# Altium project MotionBoard.PrjPcb (part 2 of 3)

## Sheet dsp.SchDoc: DSP (TMS320F28388) Connectivity
size A3; SheetNumber: 4; SheetTotal: 18
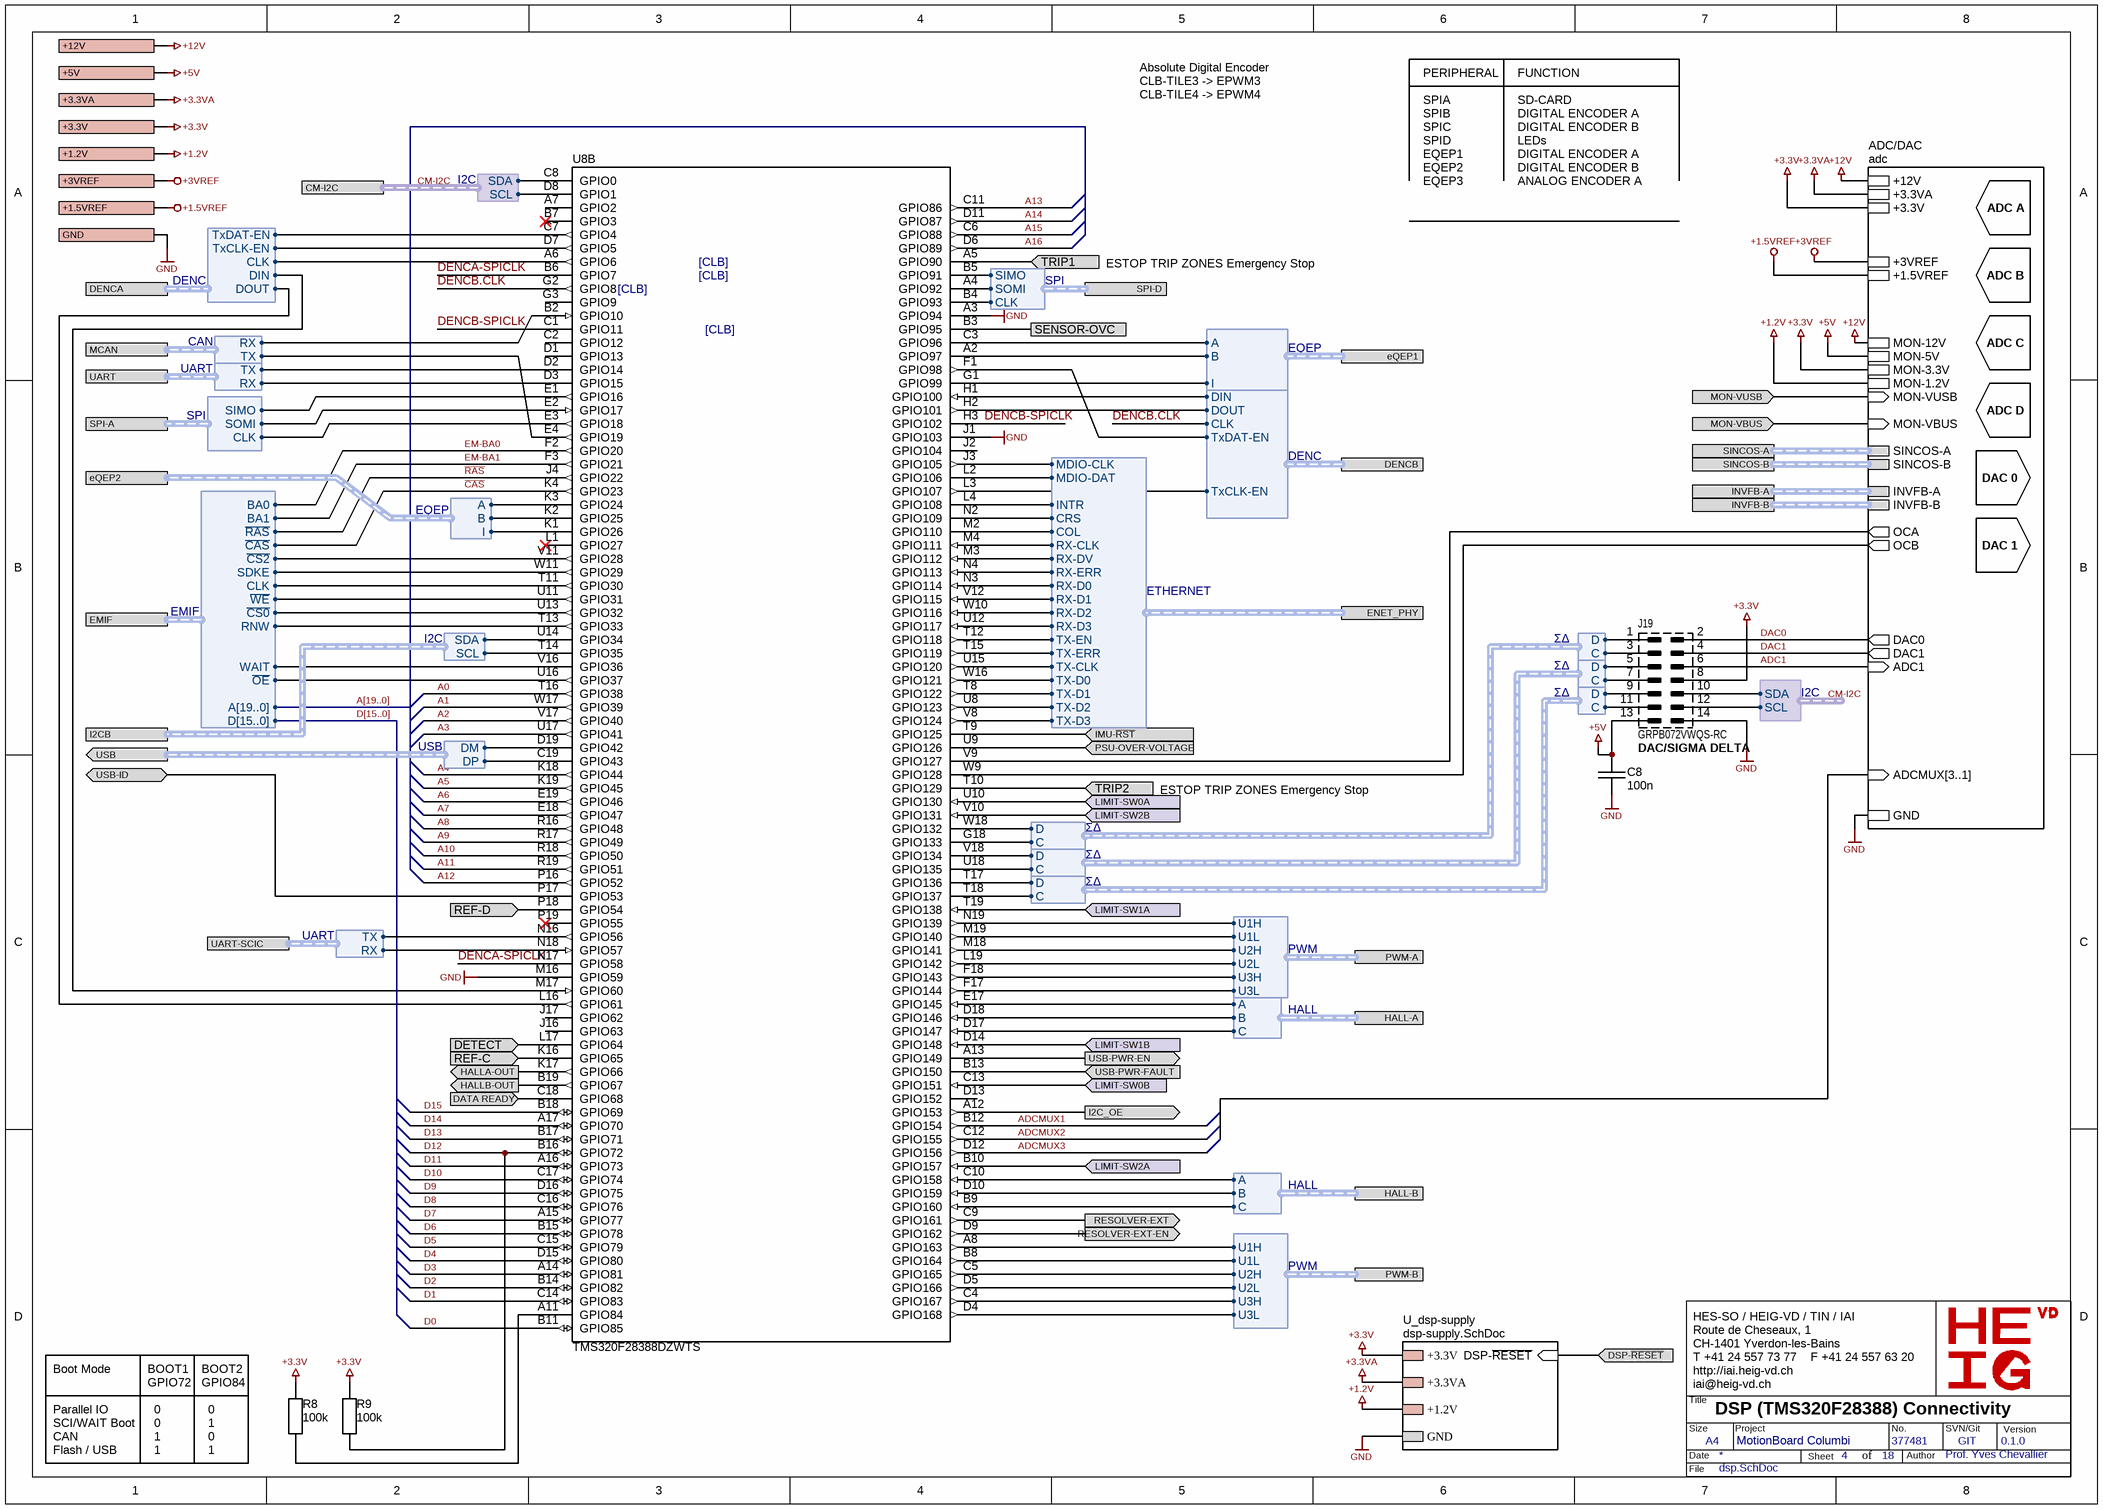
[diagram p5: dsp.SchDoc]

### Parts
C8  100n  [SM/C0402]
J19  GRPB072VWQS-RC  Function: DAC/SIGMA DELTA  [FTSH-107-04-LM-DV]
R8  100k  [SM/R0805]
R9  100k  [SM/R0805]
U8  TMS320F28388DZWTS  [BGA337C80P19X19_1600X1600X140]  (part B of 4)

### Sub-sheets
ADC/DAC = adc: INVFB-A (harness INVFB), INVFB-B (harness INVFB), SINCOS-A (harness SINCOS), SINCOS-B (harness SINCOS), +3.3VA, GND, +3.3V, OCB (out), OCA (out), ADC1 (in), MON-VUSB (in), MON-VBUS (in), DAC1 (out), DAC0 (out), +12V, MON-3.3V, MON-1.2V, MON-5V, MON-12V, +1.5VREF, +3VREF, ADCMUX[3..1] (in)
U_dsp-supply = dsp-supply.SchDoc: +3.3V, GND, +1.2V, +3.3VA, DSP-~{RESET} (in)

### Ports
+1.2V, +1.5VREF, +3.3V, +3.3VA, +3VREF, +5V, +12V, CM-I2C (harness I2C), DATA READY (in), DENCA (harness DENC), DENCB (harness DENC), DETECT (in), DSP-~{RESET} (in), EMIF (harness EMIF), ENET_PHY (harness ETHERNET), eQEP1 (harness EQEP), eQEP2 (harness EQEP), GND, HALL-A (harness HALL), HALL-B (harness HALL), HALLA-OUT (out), HALLB-OUT (out), I2C_OE (out), I2CB (harness I2C), IMU-~{RST} (in), INVFB-A (harness INVFB), INVFB-B (harness INVFB), LIMIT-SW0A (in), LIMIT-SW0B (in), LIMIT-SW1A (in), LIMIT-SW1B (in), LIMIT-SW2A (in), LIMIT-SW2B (in), MCAN (harness CAN), MON-VBUS (in), MON-VUSB (in), PSU-OVER-VOLTAGE (in), PWM-A (harness PWM), PWM-B (harness PWM), REF-C (in), REF-D (in), RESOLVER-EXT (out), RESOLVER-EXT-EN (out), SENSOR-OVC, SINCOS-A (harness SINCOS), SINCOS-B (harness SINCOS), SPI-A (harness SPI), SPI-D (harness SPI), TRIP1 (in), TRIP2 (in), UART (harness UART), UART-SCIC (harness UART), USB (out, harness USB), USB-ID (bidir), USB-PWR-EN (out), USB-PWR-FAULT (in)

### Harnesses
ETHERNET: TX-D0, TX-D1, TX-D2, TX-D3, RX-D0, RX-D1, RX-D2, RX-D3, TX-CLK, TX-EN, RX-CLK, RX-DV, TX-ERR, COL, CRS, RX-ERR, MDIO-CLK, MDIO-DAT, INTR
I2C: SDA, SCL
CAN: RX, TX
USB: DP, DM
EQEP: A, B, I
ΣΔ: C, D
EMIF: A[19..0], D[15..0], ~{RAS}, ~{CAS}, ~{OE}, SDKE, CLK, ~{CS0}, ~{CS2}, BA0, BA1, ~{WE}, RNW, WAIT
UART: TX, RX
PWM: U1H, U1L, U2H, U2L, U3H, U3L
HALL: A, B, C
DENC: CLK, DIN, DOUT, TxCLK-EN, TxDAT-EN
SPI: SIMO, SOMI, CLK

### Nets
+1.2V: port +1.2V, sheet ADC/DAC/MON-1.2V, sheet U_dsp-supply/+1.2V
+1.5VREF: port +1.5VREF, sheet ADC/DAC/+1.5VREF
+3.3V: J19.8 R8.1 R9.1 ; port +3.3V, sheet ADC/DAC/+3.3V, sheet ADC/DAC/MON-3.3V, sheet U_dsp-supply/+3.3V
+3.3VA: port +3.3VA, sheet ADC/DAC/+3.3VA, sheet U_dsp-supply/+3.3VA
+3VREF: port +3VREF, sheet ADC/DAC/+3VREF
+5V: C8.1 J19.13 ; port +5V, sheet ADC/DAC/MON-5V
+12V: port +12V, sheet ADC/DAC/+12V, sheet ADC/DAC/MON-12V
GND: C8.2 J19.14 U8.A3(GPIO94) U8.J1(GPIO103) U8.M16(GPIO59) ; port GND, sheet ADC/DAC/GND, sheet U_dsp-supply/GND
A0: U8.T16(GPIO38)
A1: U8.W17(GPIO39)
A2: U8.V17(GPIO40)
A3: U8.U17(GPIO41)
A4: U8.K18(GPIO44)
A5: U8.K19(GPIO45)
A6: U8.E19(GPIO46)
A7: U8.E18(GPIO47)
A8: U8.R16(GPIO48)
A9: U8.R17(GPIO49)
A10: U8.R18(GPIO50)
A11: U8.R19(GPIO51)
A12: U8.P16(GPIO52)
A13: U8.C11(GPIO86)
A14: U8.D11(GPIO87)
A15: U8.C6(GPIO88)
A16: U8.D6(GPIO89)
ADC1: J19.6 ; sheet ADC/DAC/ADC1
ADCMUX1: U8.B12(GPIO154)
ADCMUX2: U8.C12(GPIO155)
ADCMUX3: U8.D12(GPIO156)
~{CAS}: U8.K4(GPIO23) ; port EMIF.~{CAS}
~{CS0}: U8.U13(GPIO32) ; port EMIF.~{CS0}
~{CS2}: U8.V11(GPIO28) ; port EMIF.~{CS2}
CLK: U8.T11(GPIO30) ; port EMIF.CLK
CM-I2C.SCL: J19.12 U8.D8(GPIO1) ; port CM-I2C.SCL
CM-I2C.SDA: J19.10 U8.C8(GPIO0) ; port CM-I2C.SDA
D0: U8.B11(GPIO85)
D1: U8.C14(GPIO83)
D2: U8.B14(GPIO82)
D3: U8.A14(GPIO81)
D4: U8.D15(GPIO80)
D5: U8.C15(GPIO79)
D6: U8.B15(GPIO78)
D7: U8.A15(GPIO77)
D8: U8.C16(GPIO76)
D9: U8.D16(GPIO75)
D10: U8.C17(GPIO74)
D11: U8.A16(GPIO73)
D12: R9.2 U8.B16(GPIO72)
D13: U8.B17(GPIO71)
D14: U8.A17(GPIO70)
D15: U8.B18(GPIO69)
DAC0: J19.2 ; sheet ADC/DAC/DAC0
DAC1: J19.4 ; sheet ADC/DAC/DAC1
DATA READY: U8.C18(GPIO68) ; port DATA READY
DENCA-SPICLK: U8.B6(GPIO7) U8.N17(GPIO58)
DENCB-SPICLK: U8.C1(GPIO11) U8.H3(GPIO102)
DENCB.CLK: U8.G2(GPIO8) ; port DENCB.CLK
DETECT: U8.L17(GPIO64) ; port DETECT
DSP-~{XRST}: port DSP-~{RESET}, sheet U_dsp-supply/DSP-~{RESET}
EM-BA0: U8.F2(GPIO20) ; port EMIF.BA0  [project net BA0]
EM-BA1: U8.F3(GPIO21) ; port EMIF.BA1  [project net BA1]
ExEn: U8.D9(GPIO162) ; port RESOLVER-EXT-EN
ExIn: U8.C9(GPIO161) ; port RESOLVER-EXT
HALLA-OUT: U8.K17(GPIO66) ; port HALLA-OUT
HALLB-OUT: U8.B19(GPIO67) ; port HALLB-OUT
I2C_OE: U8.A12(GPIO153) ; port I2C_OE
ID: U8.P17(GPIO53) ; port USB-ID
IMU-~{RST}: U8.T9(GPIO125) ; port IMU-~{RST}
LIMIT-SW0A: U8.U10(GPIO130) ; port LIMIT-SW0A
LIMIT-SW0B: U8.C13(GPIO151) ; port LIMIT-SW0B
LIMIT-SW1A: U8.T19(GPIO138) ; port LIMIT-SW1A
LIMIT-SW1B: U8.D14(GPIO148) ; port LIMIT-SW1B
LIMIT-SW2A: U8.B10(GPIO157) ; port LIMIT-SW2A
LIMIT-SW2B: U8.V10(GPIO131) ; port LIMIT-SW2B
MON-VBUS: port MON-VBUS, sheet ADC/DAC/MON-VBUS
MON-VUSB: port MON-VUSB, sheet ADC/DAC/MON-VUSB
~{OE}: U8.U16(GPIO37) ; port EMIF.~{OE}
OCA: U8.V9(GPIO127) ; sheet ADC/DAC/OCA
OCB: U8.W9(GPIO128) ; sheet ADC/DAC/OCB
PSU-OVER-VOLTAGE: U8.U9(GPIO126) ; port PSU-OVER-VOLTAGE
PWR-EN: U8.A13(GPIO149) ; port USB-PWR-EN
PWR-FAULT: U8.B13(GPIO150) ; port USB-PWR-FAULT
~{RAS}: U8.J4(GPIO22) ; port EMIF.~{RAS}
REF-C: U8.K16(GPIO65) ; port REF-C
REF-D: U8.P18(GPIO54) ; port REF-D
SDKE: U8.W11(GPIO29) ; port EMIF.SDKE
SENSOR-OVC: U8.B3(GPIO95) ; port SENSOR-OVC
TRIP1: U8.A5(GPIO90) ; port TRIP1
TRIP2: U8.T10(GPIO129) ; port TRIP2
USB_N: U8.D19(GPIO42) ; port USB.DM
USB_P: U8.C19(GPIO43) ; port USB.DP
~{WE}: U8.U11(GPIO31) ; port EMIF.~{WE}
NetJ19_1: J19.1 U8.W18(GPIO132) ; harness ΣΔ.D
NetJ19_3: J19.3 U8.G18(GPIO133) ; harness ΣΔ.C
NetJ19_5: J19.5 U8.V18(GPIO134) ; harness ΣΔ.D
NetJ19_7: J19.7 U8.U18(GPIO135) ; harness ΣΔ.C
NetJ19_9: J19.9 U8.T17(GPIO136) ; harness ΣΔ.D
NetJ19_11: J19.11 U8.T18(GPIO137) ; harness ΣΔ.C
NetR8_2: R8.2 U8.A11(GPIO84)
NetR44_2: U8.L2(GPIO106) ; port ENET_PHY.MDIO-DAT
NetU8_A2: U8.A2(GPIO97) U8.M17(GPIO60) ; port eQEP1.B, port DENCA.DIN
NetU8_A4: U8.A4(GPIO92) ; port SPI-D.SOMI
NetU8_A6: U8.A6(GPIO6) ; port DENCA.CLK
NetU8_A8: U8.A8(GPIO163) ; port PWM-B.U1H
NetU8_B2: U8.B2(GPIO10) ; port MCAN.RX
NetU8_B4: U8.B4(GPIO93) ; port SPI-D.CLK
NetU8_B5: U8.B5(GPIO91) ; port SPI-D.SIMO
NetU8_B8: U8.B8(GPIO164) ; port PWM-B.U1L
NetU8_B9: U8.B9(GPIO160) ; port HALL-B.C
NetU8_C3: U8.C3(GPIO96) ; port eQEP1.A
NetU8_C4: U8.C4(GPIO167) ; port PWM-B.U3H
NetU8_C5: U8.C5(GPIO165) ; port PWM-B.U2H
NetU8_C7: U8.C7(GPIO4) ; port DENCA.TxDAT-EN
NetU8_C10: U8.C10(GPIO158) ; port HALL-B.A
NetU8_D2: U8.D2(GPIO14) ; port UART.TX
NetU8_D3: U8.D3(GPIO15) ; port UART.RX
NetU8_D4: U8.D4(GPIO168) ; port PWM-B.U3L
NetU8_D5: U8.D5(GPIO166) ; port PWM-B.U2L
NetU8_D7: U8.D7(GPIO5) ; port DENCA.TxCLK-EN
NetU8_D10: U8.D10(GPIO159) ; port HALL-B.B
NetU8_D17: U8.D17(GPIO147) ; port HALL-A.C
NetU8_D18: U8.D18(GPIO146) ; port HALL-A.B
NetU8_E1: U8.E1(GPIO16) ; port SPI-A.SIMO
NetU8_E2: U8.E2(GPIO17) ; port SPI-A.SOMI
NetU8_E3: U8.E3(GPIO18) ; port SPI-A.CLK
NetU8_E4: U8.E4(GPIO19) ; port MCAN.TX
NetU8_E17: U8.E17(GPIO145) ; port HALL-A.A
NetU8_F1: U8.F1(GPIO98) ; port DENCB.TxDAT-EN
NetU8_F17: U8.F17(GPIO144) ; port PWM-A.U3L
NetU8_F18: U8.F18(GPIO143) ; port PWM-A.U3H
NetU8_G1: U8.G1(GPIO99) ; port eQEP1.I
NetU8_H1: U8.H1(GPIO100) U8.K2(GPIO25) ; port eQEP2.B, port DENCB.DIN
NetU8_H2: U8.H2(GPIO101) ; port DENCB.DOUT
NetU8_J3: U8.J3(GPIO105) ; port ENET_PHY.MDIO-CLK
NetU8_K1: U8.K1(GPIO26) ; port eQEP2.I
NetU8_K3: U8.K3(GPIO24) ; port eQEP2.A
NetU8_L3: U8.L3(GPIO107) ; port DENCB.TxCLK-EN
NetU8_L4: U8.L4(GPIO108) ; port ENET_PHY.INTR
NetU8_L16: U8.L16(GPIO61) ; port DENCA.DOUT
NetU8_L19: U8.L19(GPIO142) ; port PWM-A.U2L
NetU8_M2: U8.M2(GPIO110) ; port ENET_PHY.COL
NetU8_M3: U8.M3(GPIO112) ; port ENET_PHY.RX-DV
NetU8_M4: U8.M4(GPIO111) ; port ENET_PHY.RX-CLK
NetU8_M18: U8.M18(GPIO141) ; port PWM-A.U2H
NetU8_M19: U8.M19(GPIO140) ; port PWM-A.U1L
NetU8_N2: U8.N2(GPIO109) ; port ENET_PHY.CRS
NetU8_N3: U8.N3(GPIO114) ; port ENET_PHY.RX-D0
NetU8_N4: U8.N4(GPIO113) ; port ENET_PHY.RX-ERR
NetU8_N16: U8.N16(GPIO56) ; port UART-SCIC.TX
NetU8_N18: U8.N18(GPIO57) ; port UART-SCIC.RX
NetU8_N19: U8.N19(GPIO139) ; port PWM-A.U1H
NetU8_T8: U8.T8(GPIO122) ; port ENET_PHY.TX-D1
NetU8_T12: U8.T12(GPIO118) ; port ENET_PHY.TX-EN
NetU8_T13: U8.T13(GPIO33) ; port EMIF.RNW
NetU8_T14: U8.T14(GPIO35) ; port I2CB.SCL
NetU8_T15: U8.T15(GPIO119) ; port ENET_PHY.TX-ERR
NetU8_U8: U8.U8(GPIO123) ; port ENET_PHY.TX-D2
NetU8_U12: U8.U12(GPIO117) ; port ENET_PHY.RX-D3
NetU8_U14: U8.U14(GPIO34) ; port I2CB.SDA
NetU8_U15: U8.U15(GPIO120) ; port ENET_PHY.TX-CLK
NetU8_V8: U8.V8(GPIO124) ; port ENET_PHY.TX-D3
NetU8_V12: U8.V12(GPIO115) ; port ENET_PHY.RX-D1
NetU8_V16: U8.V16(GPIO36) ; port EMIF.WAIT
NetU8_W10: U8.W10(GPIO116) ; port ENET_PHY.RX-D2
NetU8_W16: U8.W16(GPIO121) ; port ENET_PHY.TX-D0

Not connected (* = marked no-connect by the designer): U8 A7(GPIO2) B7(GPIO3)* C2(GPIO12) D1(GPIO13) D13(GPIO152) G3(GPIO9) J2(GPIO104) J16(GPIO63) J17(GPIO62) L1(GPIO27)* P19(GPIO55)*

### Buses and harness runs
bus A[19..0]
bus D[15..0]
harness CM-I2C = port CM-I2C
harness port INVFB-A = sheet ADC/DAC/INVFB-A
harness port INVFB-B = sheet ADC/DAC/INVFB-B
harness port SINCOS-A = sheet ADC/DAC/SINCOS-A
harness port SINCOS-B = sheet ADC/DAC/SINCOS-B

### Notes on the sheet
- SPIA
- SPIB
- PERIPHERAL
- SD-CARD
- DIGITAL ENCODER A
- FUNCTION
- Absolute Digital Encoder
  CLB-TILE3 -> EPWM3
  CLB-TILE4 -> EPWM4
- SPIC
- SPID
- EQEP1
- EQEP2
- EQEP3
- DIGITAL ENCODER B
- LEDs
- ANALOG ENCODER A
- ADC A
- (near U8) [CLB]
- ESTOP TRIP ZONES Emergency Stop
- ADC B
- ADC C
- ADC D
- DAC 0
- DAC 1
- Boot Mode
- BOOT1
- GPIO72
- BOOT2
- GPIO84
- Parallel IO
- SCI/WAIT Boot
- CAN
- Flash / USB
- 0
- 1
- HES-SO / HEIG-VD / TIN / IAI
  Route de Cheseaux, 1
  CH-1401 Yverdon-les-Bains
  T +41 24 557 73 77    F +41 24 557 63 20
  http://iai.heig-vd.ch
  iai@heig-vd.ch
- Title
- Size
- Date
- A4
- Project
- Sheet
- of
- No.
- Author
- SVN/Git
- Version
- File

### Library data of the parts
C8 = CAP CER 100NF 25V X5R 0402: as C170 on sheet inverter; Voltage: 25V; Dielectric: X5R; Supplier 1: Digi-Key; Supplier Part Number 1: 1276-1043-1-ND; Value: 100n
J19 = CONN HEADER SMD 14POS 1.27MM: Connector Header Surface Mount 14 position 0.050" (1.27mm); Supplier 1: Digi-Key; Supplier Part Number 1: S9012E-07-ND
R8 R9 = RES 100K OHM 1% 1/16W 0402: 100 kOhms ±1% 0.063W, 1/16W Chip Resistor 0402 (1005 Metric) Moisture Resistant Thick Film; Supplier 1: Digi-Key; Supplier Part Number 1: 13-RC0402FR-13100KLCT-ND; Value: 100k
U8 = TMS320F28388DZWTS: C28x C2000™ C28x Fixed-Point Microcontroller IC 32-Bit Dual-Core 200MHz 512KB (256K x 16) FLASH 337-NFBGA (16x16); Manufacturer: Texas Instruments; Datasheet Link: http://www.ti.com/lit/ds/symlink/tms320f28388d.pdf; Height: 1.4mm; Supplier 1: Mouser; Supplier Part Number 1: 595-F28388DZWTS; Manufacturer Part Number: F28388DZWTS

## Sheet adc.SchDoc: TMS320F28388 ADC/DAC
size A3; SheetNumber: 5; SheetTotal: 17
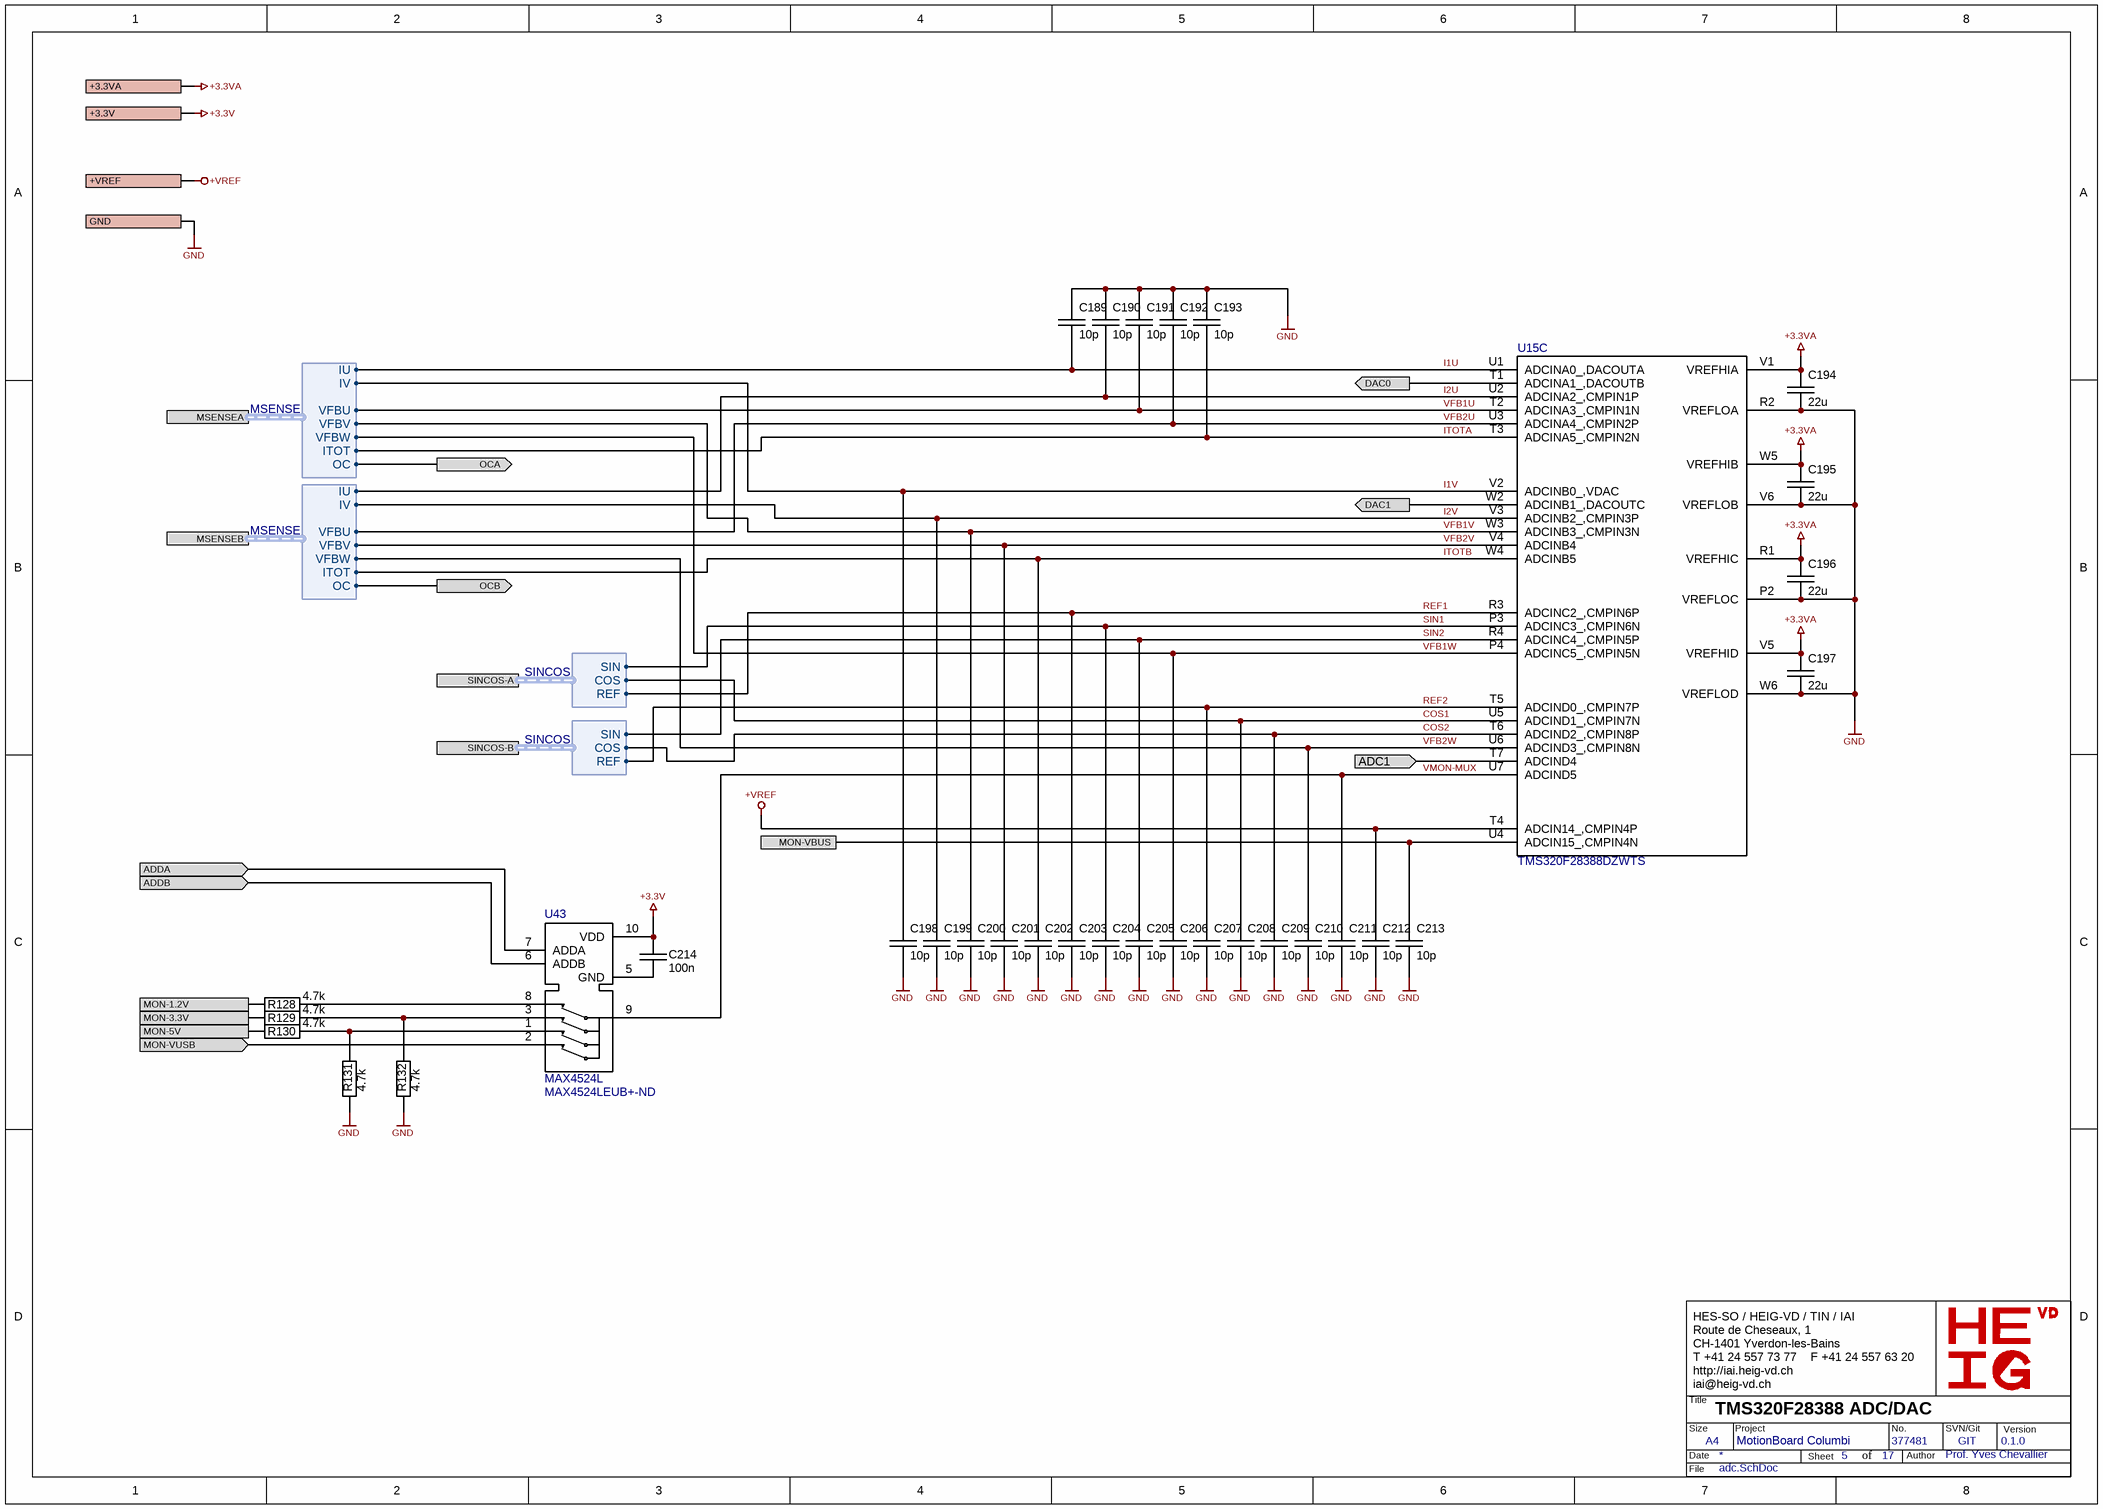
[diagram p6: adc.SchDoc]

### Parts
(Parts that share a designator on the sheet are numbered #1, #2 ... from top to bottom, then left to right.)
C189  10p  [SM/C0201]
C190  10p  [SM/C0201]
C191  10p  [SM/C0201]
C192  10p  [SM/C0201]
C193  10p  [SM/C0201]
C194  22u  [SM/C0402]
C195  22u  [SM/C0402]
C196  22u  [SM/C0402]
C197  22u  [SM/C0402]
C198  10p  [SM/C0201]
C199  10p  [SM/C0201]
C200  10p  [SM/C0201]
C201#1  10p  [SM/C0201]
C202#1  10p  [SM/C0201]
C203#1  10p  [SM/C0201]
C204#1  10p  [SM/C0201]
C205#1  10p  [SM/C0201]
C206#1  10p  [SM/C0201]
C207#1  10p  [SM/C0201]
C208#1  10p  [SM/C0201]
C209#1  10p  [SM/C0201]
C210#1  10p  [SM/C0201]
C211#1  10p  [SM/C0201]
C212#1  10p  [SM/C0201]
C213#1  10p  [SM/C0201]
C214#1  100n  [SM/C0402]
R128  4.7k  [SM/R0402]
R129  4.7k  [SM/R0402]
R130  4.7k  [SM/R0402]
R131  4.7k  [SM/R0402]
R132  4.7k  [SM/R0402]
U15#1  TMS320F28388DZWTS  [BGA337C80P19X19_1600X1600X140]  (part C of 4)
U43  MAX4524L  Supplier Part Number 1: MAX4524LEUB+-ND  [MSOP10]

### Ports
+3.3V, +3.3VA, +VREF, ADC1 (in), ADDA (in), ADDB (in), DAC0 (out), DAC1 (out), GND, MON-1.2V, MON-3.3V, MON-5V, MON-VBUS, MON-VUSB (in), MSENSEA (harness MSENSE), MSENSEB (harness MSENSE), OCA (out), OCB (out), SINCOS-A (harness SINCOS), SINCOS-B (harness SINCOS)

### Harnesses
MSENSE: IU, IV, VFBU, VFBV, ITOT, OC, VFBW
SINCOS: SIN, COS, REF

### Nets
+1.2V: R128.1 ; port MON-1.2V
+3.3V: C214#1.1 R129.1 U43.10(VDD) ; port +3.3V, port MON-3.3V
+3.3VA: C194.1 C195.1 C196.1 C197.1 U15#1.R1(VREFHIC) U15#1.V1(VREFHIA) U15#1.V5(VREFHID) U15#1.W5(VREFHIB) ; port +3.3VA
+5V: R130.1 ; port MON-5V
+VREF: C212#1.1 U15#1.T4(ADCIN14_,CMPIN4P) ; port +VREF
GND: C189.1 C190.1 C191.1 C192.1 C193.1 C194.2 C195.2 C196.2 C197.2 C198.2 C199.2 C200.2 C201#1.2 C202#1.2 C203#1.2 C204#1.2 C205#1.2 C206#1.2 C207#1.2 C208#1.2 C209#1.2 C210#1.2 C211#1.2 C212#1.2 C213#1.2 R131.2 R132.2 U15#1.P2(VREFLOC) U15#1.R2(VREFLOA) U15#1.V6(VREFLOB) U15#1.W6(VREFLOD) ; port GND
ADC1: U15#1.T7(ADCIND4) ; port ADC1
ADDA: U43.7(ADDA) ; port ADDA
ADDB: U43.6(ADDB) ; port ADDB
COS1: C208#1.1 U15#1.U5(ADCIND1_,CMPIN7N) ; port SINCOS-A.COS
COS2: C209#1.1 U15#1.T6(ADCIND2_,CMPIN8P) ; port SINCOS-B.COS
DAC0: U15#1.T1(ADCINA1_,DACOUTB) ; port DAC0
DAC1: U15#1.W2(ADCINB1_,DACOUTC) ; port DAC1
I1U: C189.2 U15#1.U1(ADCINA0_,DACOUTA) ; port MSENSEA.IU
I1V: C198.1 U15#1.V2(ADCINB0_,VDAC) ; port MSENSEA.IV
I2U: C190.2 U15#1.U2(ADCINA2_,CMPIN1P) ; port MSENSEB.IU
I2V: C199.1 U15#1.V3(ADCINB2_,CMPIN3P) ; port MSENSEB.IV
ITOTA: C193.2 U15#1.T3(ADCINA5_,CMPIN2N) ; port MSENSEA.ITOT
ITOTB: C202#1.1 U15#1.W4(ADCINB5) ; port MSENSEB.ITOT
MON-VBUS: C213#1.1 U15#1.U4(ADCIN15_,CMPIN4N) ; port MON-VBUS
MON-VUSB: U43.2(NO3) ; port MON-VUSB
OCA: port OCA, port MSENSEA.OC
OCB: port OCB, port MSENSEB.OC
REF1: C203#1.1 U15#1.R3(ADCINC2_,CMPIN6P) ; port SINCOS-A.REF
REF2: C207#1.1 U15#1.T5(ADCIND0_,CMPIN7P) ; port SINCOS-B.REF
SIN1: C204#1.1 U15#1.P3(ADCINC3_,CMPIN6N) ; port SINCOS-A.SIN
SIN2: C205#1.1 U15#1.R4(ADCINC4_,CMPIN5P) ; port SINCOS-B.SIN
VFB1U: C191.2 U15#1.T2(ADCINA3_,CMPIN1N) ; port MSENSEA.VFBU
VFB1V: C200.1 U15#1.W3(ADCINB3_,CMPIN3N) ; port MSENSEA.VFBV
VFB1W: C206#1.1 U15#1.P4(ADCINC5_,CMPIN5N) ; port MSENSEA.VFBW
VFB2U: C192.2 U15#1.U3(ADCINA4_,CMPIN2P) ; port MSENSEB.VFBU
VFB2V: C201#1.1 U15#1.V4(ADCINB4) ; port MSENSEB.VFBV
VFB2W: C210#1.1 U15#1.U6(ADCIND3_,CMPIN8N) ; port MSENSEB.VFBW
VMON-MUX: C211#1.1 U15#1.U7(ADCIND5) U43.9(COM)
NetC214#1_2: C214#1.2 U43.5(GND)
NetR128_2: R128.2 U43.8(NO0)
NetR129_2: R129.2 R132.1 U43.3(NO1)
NetR130_2: R130.2 R131.1 U43.1(NO2)

### Notes on the sheet
- HES-SO / HEIG-VD / TIN / IAI
  Route de Cheseaux, 1
  CH-1401 Yverdon-les-Bains
  T +41 24 557 73 77    F +41 24 557 63 20
  http://iai.heig-vd.ch
  iai@heig-vd.ch
- Title
- Size
- Date
- A4
- Project
- Sheet
- of
- No.
- Author
- SVN/Git
- Version
- File

### Library data of the parts
C189-C193 C198-C200 C201#1 C202#1 C203#1 C204#1 C205#1 C206#1 C207#1 C208#1 C209#1 C210#1 C211#1 C212#1 C213#1 = C: Chip Capacitor; Voltage: 16V; Dielectric: X7R; Supplier 1: Digi-Key; Supplier Part Number 1: 490-8607-1-ND; Value: 10p
C194-C197 = C: Chip Capacitor; Voltage: 6.3V; Dielectric: X5R; Supplier 1: Digi-Key; Supplier Part Number 1: 478-9839-1-ND; Value: 22u
C214#1 = C: 0.1 µF ±10% 25V Ceramic Capacitor X5R 0402 (1005 Metric); Dielectric: X5R; Supplier 1: Digi-Key; Supplier Part Number 1: 1276-1043-1-ND; Value: 100n; Voltage: 25V
R128-R132 = R: 4.7 kOhms ±5% 0.063W, 1/16W Chip Resistor 0402 (1005 Metric) Moisture Resistant Thick Film; Supplier 1: Digi-Key; Supplier Part Number 1: 311-4.7KJRCT-ND; Value: 4.7k
U15#1 = TMS320F28388DZWTS: Integrated Circuit; Datasheet Link: http://www.ti.com/lit/ds/symlink/tms320f28388d.pdf; Height: 1.4mm; Supplier 1: Mouser; Supplier Part Number 1: 595-F28388DZWTS
U43 = MAX4524L: 1 Circuit IC Switch 4:1 80Ohm 10-uMAX/uSOP / IC MUX/SW ANLG CMOS LV 10UMAX; Supplier 1: Digi-Key

## Sheet dsp-supply.SchDoc: DSP Supply
size A3; SheetNumber: 6; SheetTotal: 18
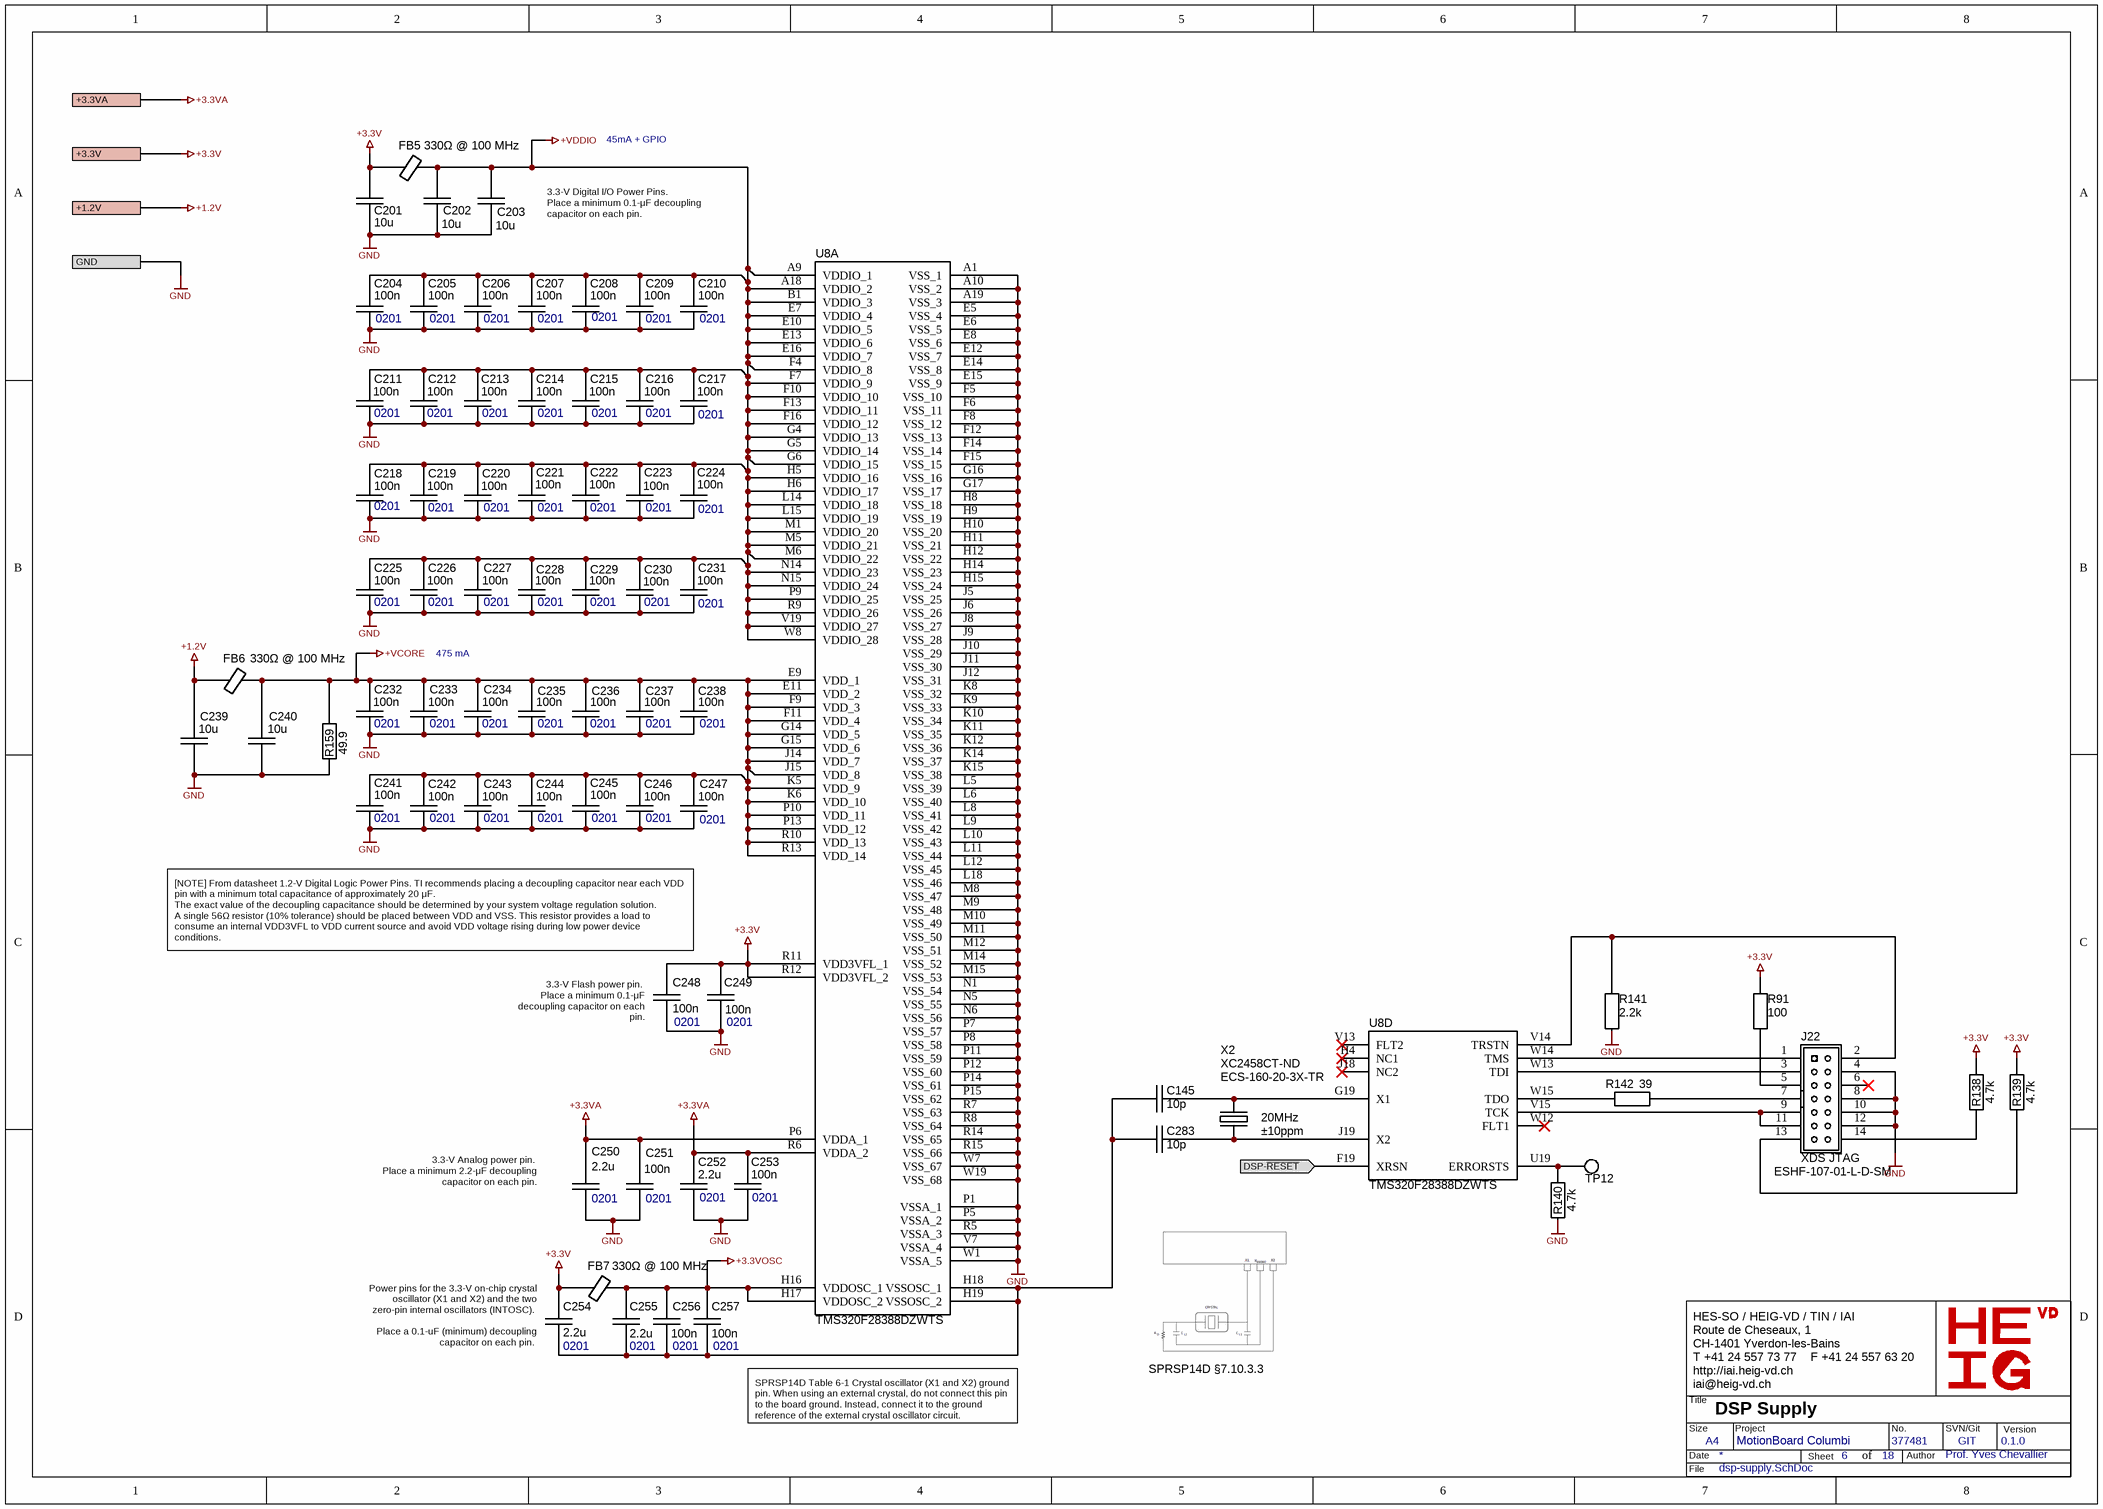
[diagram p7: dsp-supply.SchDoc]

### Parts
(Parts that share a designator on the sheet are numbered #1, #2 ... from top to bottom, then left to right.)
C145  10p  [SM/C0402]
C201#2  10u  [SM/C0402]
C202#2  10u  [SM/C0402]
C203#2  10u  [SM/C0402]
C204#2  100n  Case: 0201  [SM/C0201]
C205#2  100n  Case: 0201  [SM/C0201]
C206#2  100n  Case: 0201  [SM/C0201]
C207#2  100n  Case: 0201  [SM/C0201]
C208#2  100n  Case: 0201  [SM/C0201]
C209#2  100n  Case: 0201  [SM/C0201]
C210#2  100n  Case: 0201  [SM/C0201]
C211#2  100n  Case: 0201  [SM/C0201]
C212#2  100n  Case: 0201  [SM/C0201]
C213#2  100n  Case: 0201  [SM/C0201]
C214#2  100n  Case: 0201  [SM/C0201]
C215  100n  Case: 0201  [SM/C0201]
C216  100n  Case: 0201  [SM/C0201]
C217  100n  Case: 0201  [SM/C0201]
C218  100n  Case: 0201  [SM/C0201]
C219  100n  Case: 0201  [SM/C0201]
C220  100n  Case: 0201  [SM/C0201]
C221  100n  Case: 0201  [SM/C0201]
C222  100n  Case: 0201  [SM/C0201]
C223  100n  Case: 0201  [SM/C0201]
C224  100n  Case: 0201  [SM/C0201]
C225  100n  Case: 0201  [SM/C0201]
C226  100n  Case: 0201  [SM/C0201]
C227  100n  Case: 0201  [SM/C0201]
C228  100n  Case: 0201  [SM/C0201]
C229  100n  Case: 0201  [SM/C0201]
C230  100n  Case: 0201  [SM/C0201]
C231  100n  Case: 0201  [SM/C0201]
C232  100n  Case: 0201  [SM/C0201]
C233  100n  Case: 0201  [SM/C0201]
C234  100n  Case: 0201  [SM/C0201]
C235  100n  Case: 0201  [SM/C0201]
C236  100n  Case: 0201  [SM/C0201]
C237  100n  Case: 0201  [SM/C0201]
C238  100n  Case: 0201  [SM/C0201]
C239  10u  [SM/C0402]
C240  10u  [SM/C0402]
C241  100n  Case: 0201  [SM/C0201]
C242  100n  Case: 0201  [SM/C0201]
C243  100n  Case: 0201  [SM/C0201]
C244  100n  Case: 0201  [SM/C0201]
C245  100n  Case: 0201  [SM/C0201]
C246  100n  Case: 0201  [SM/C0201]
C247  100n  Case: 0201  [SM/C0201]
C248  100n  Case: 0201  [SM/C0201]
C249  100n  Case: 0201  [SM/C0201]
C250  2.2u  Case: 0201  [SM/C0201]
C251  100n  Case: 0201  [SM/C0201]
C252  2.2u  Case: 0201  [SM/C0201]
C253  100n  Case: 0201  [SM/C0201]
C254  2.2u  Case: 0201  [SM/C0201]
C255  2.2u  Case: 0201  [SM/C0201]
C256  100n  Case: 0201  [SM/C0201]
C257  100n  Case: 0201  [SM/C0201]
C283  10p  [SM/C0402]
FB5  value 330Ω @ 100 MHz  [SM/L0603]  (hidden comment: BLM18KG331SN1D)
FB6#1  value 330Ω @ 100 MHz  [SM/L0603]  (hidden comment: BLM18KG331SN1D)
FB7#1  value 330Ω @ 100 MHz  [SM/L0603]  (hidden comment: BLM18KG331SN1D)
J22  ESHF-107-01-L-D-SM  Function: XDS JTAG  [SAMTEC_SHF-107-01-L-D-SM]
R91  100  [SM/R0402]
R138  4.7k  [SM/R0402]
R139  4.7k  [SM/R0402]
R140  4.7k  [SM/R0402]
R141  2.2k  [SM/R0402]
R142  39  [SM/R0402]
R159  49.9  [SM/R0402]
TP12  RCUCTE  [TP/RCUCT]  (value not drawn)
U8  TMS320F28388DZWTS  [BGA337C80P19X19_1600X1600X140]  (parts A,D of 4)
X2  ECS-160-20-3X-TR  value 20MHz  Stability: ±10ppm  Supplier Part Number 1: XC2458CT-ND

### Ports
+1.2V, +3.3V, +3.3VA, DSP-~{RESET} (in), GND

### Nets
+1.2V: C239.1 FB6#1.1 ; port +1.2V
+3.3V: C201#2.1 C248.1 C249.1 C254.1 FB5.1 FB7#1.1 R91.2 R138.1 R139.1 U8.R11(VDD3VFL_1) U8.R12(VDD3VFL_2) ; port +3.3V
+3.3VA: C250.1 C251.1 C252.1 C253.1 U8.P6(VDDA_1) U8.R6(VDDA_2) ; port +3.3VA
+3.3VOSC: C255.1 C256.1 C257.1 FB7#1.2 U8.H16(VDDOSC_1) U8.H17(VDDOSC_2)
+VCORE: C232.1 C233.1 C234.1 C235.1 C236.1 C237.1 C238.1 C240.1 C241.1 C242.1 C243.1 C244.1 C245.1 C246.1 C247.1 FB6#1.2 R159.1 U8.E9(VDD_1) U8.E11(VDD_2) U8.F9(VDD_3) U8.F11(VDD_4) U8.G14(VDD_5) U8.G15(VDD_6) U8.J14(VDD_7) U8.J15(VDD_8) U8.K5(VDD_9) U8.K6(VDD_10) U8.P10(VDD_11) U8.P13(VDD_12) U8.R10(VDD_13) U8.R13(VDD_14)
+VDDIO: C202#2.1 C203#2.1 C204#2.1 C205#2.1 C206#2.1 C207#2.1 C208#2.1 C209#2.1 C210#2.1 C211#2.1 C212#2.1 C213#2.1 C214#2.1 C215.1 C216.1 C217.1 C218.1 C219.1 C220.1 C221.1 C222.1 C223.1 C224.1 C225.1 C226.1 C227.1 C228.1 C229.1 C230.1 C231.1 FB5.2 U8.A9(VDDIO_1) U8.A18(VDDIO_2) U8.B1(VDDIO_3) U8.E7(VDDIO_4) U8.E10(VDDIO_5) U8.E13(VDDIO_6) U8.E16(VDDIO_7) U8.F4(VDDIO_8) U8.F7(VDDIO_9) U8.F10(VDDIO_10) U8.F13(VDDIO_11) U8.F16(VDDIO_12) U8.G4(VDDIO_13) U8.G5(VDDIO_14) U8.G6(VDDIO_15) U8.H5(VDDIO_16) U8.H6(VDDIO_17) U8.L14(VDDIO_18) U8.L15(VDDIO_19) U8.M1(VDDIO_20) U8.M5(VDDIO_21) U8.M6(VDDIO_22) U8.N14(VDDIO_23) U8.N15(VDDIO_24) U8.P9(VDDIO_25) U8.R9(VDDIO_26) U8.V19(VDDIO_27) U8.W8(VDDIO_28)
GND: C201#2.2 C202#2.2 C203#2.2 C204#2.2 C205#2.2 C206#2.2 C207#2.2 C208#2.2 C209#2.2 C210#2.2 C211#2.2 C212#2.2 C213#2.2 C214#2.2 C215.2 C216.2 C217.2 C218.2 C219.2 C220.2 C221.2 C222.2 C223.2 C224.2 C225.2 C226.2 C227.2 C228.2 C229.2 C230.2 C231.2 C232.2 C233.2 C234.2 C235.2 C236.2 C237.2 C238.2 C239.2 C240.2 C241.2 C242.2 C243.2 C244.2 C245.2 C246.2 C247.2 C248.2 C249.2 C250.2 C251.2 C252.2 C253.2 J22.4 J22.8 J22.10 J22.12 R140.2 R141.2 R159.2 U8.A1(VSS_1) U8.A10(VSS_2) U8.A19(VSS_3) U8.E5(VSS_4) U8.E6(VSS_5) U8.E8(VSS_6) U8.E12(VSS_7) U8.E14(VSS_8) U8.E15(VSS_9) U8.F5(VSS_10) U8.F6(VSS_11) U8.F8(VSS_12) U8.F12(VSS_13) U8.F14(VSS_14) U8.F15(VSS_15) U8.G16(VSS_16) U8.G17(VSS_17) U8.H8(VSS_18) U8.H9(VSS_19) U8.H10(VSS_20) U8.H11(VSS_21) U8.H12(VSS_22) U8.H14(VSS_23) U8.H15(VSS_24) U8.J5(VSS_25) U8.J6(VSS_26) U8.J8(VSS_27) U8.J9(VSS_28) U8.J10(VSS_29) U8.J11(VSS_30) U8.J12(VSS_31) U8.K8(VSS_32) U8.K9(VSS_33) U8.K10(VSS_34) U8.K11(VSS_35) U8.K12(VSS_36) U8.K14(VSS_37) U8.K15(VSS_38) U8.L5(VSS_39) U8.L6(VSS_40) U8.L8(VSS_41) U8.L9(VSS_42) U8.L10(VSS_43) U8.L11(VSS_44) U8.L12(VSS_45) U8.L18(VSS_46) U8.M8(VSS_47) U8.M9(VSS_48) U8.M10(VSS_49) U8.M11(VSS_50) U8.M12(VSS_51) U8.M14(VSS_52) U8.M15(VSS_53) U8.N1(VSS_54) U8.N5(VSS_55) U8.N6(VSS_56) U8.P1(VSSA_1) U8.P5(VSSA_2) U8.P7(VSS_57) U8.P8(VSS_58) U8.P11(VSS_59) U8.P12(VSS_60) U8.P14(VSS_61) U8.P15(VSS_62) U8.R5(VSSA_3) U8.R7(VSS_63) U8.R8(VSS_64) U8.R14(VSS_65) U8.R15(VSS_66) U8.V7(VSSA_4) U8.W1(VSSA_5) U8.W7(VSS_67) U8.W19(VSS_68) ; port GND
DSP-~{XRST}: U8.F19(XRSN) ; port DSP-~{RESET}
NetC145_1: C145.1 U8.G19(X1) X2.2
NetC145_2: C145.2 C254.2 C255.2 C256.2 C257.2 C283.2 U8.H18(VSSOSC_1) U8.H19(VSSOSC_2)
NetC283_1: C283.1 U8.J19(X2) X2.1
NetJ22_1: J22.1 U8.W14(TMS)
NetJ22_2: J22.2 R141.1 U8.V14(TRSTN)
NetJ22_3: J22.3 U8.W13(TDI)
NetJ22_5: J22.5 R91.1
NetJ22_7: J22.7 R142.2
NetJ22_9: J22.9 J22.11 U8.V15(TCK)
NetJ22_13: J22.13 R139.2
NetJ22_14: J22.14 R138.2
NetR140_1: R140.1 TP12.1 U8.U19(ERRORSTS)
NetR142_1: R142.1 U8.W15(TDO)

Not connected (* = marked no-connect by the designer): J22 6*; U8 H4(NC1)* J18(NC2)* V13(FLT2)* W12(FLT1)*

### Notes on the sheet
- 45mA + GPIO
- 3.3-V Digital I/O Power Pins.
  Place a minimum 0.1-μF decoupling capacitor on each pin.
- 475 mA
- [NOTE] From datasheet 1.2-V Digital Logic Power Pins. TI recommends placing a decoupling capacitor near each VDD pin with a minimum total capacitance of approximately 20 μF.
  The exact value of the decoupling capacitance should be determined by your system voltage regulation solution.
  A single 56Ω resistor (10% tolerance) should be placed between VDD and VSS. This resistor provides a load to consume an internal VDD3VFL to VDD current source and avoid VDD voltage rising during low power device
  conditions.
- (near C248) 3.3-V Flash power pin.
  Place a minimum 0.1-μF decoupling capacitor on each pin.
- (near C250) 3.3-V Analog power pin.
  Place a minimum 2.2-μF decoupling capacitor on each pin.
- (near C254) Power pins for the 3.3-V on-chip crystal oscillator (X1 and X2) and the two zero-pin internal oscillators (INTOSC).
  Place a 0.1-uF (minimum) decoupling capacitor on each pin.
- SPRSP14D §7.10.3.3
- SPRSP14D Table 6-1 Crystal oscillator (X1 and X2) ground pin. When using an external crystal, do not connect this pin to the board ground. Instead, connect it to the ground reference of the external crystal oscillator circuit.
- HES-SO / HEIG-VD / TIN / IAI
  Route de Cheseaux, 1
  CH-1401 Yverdon-les-Bains
  T +41 24 557 73 77    F +41 24 557 63 20
  http://iai.heig-vd.ch
  iai@heig-vd.ch
- Title
- Size
- Date
- A4
- Project
- Sheet
- of
- No.
- Author
- SVN/Git
- Version
- File

### Library data of the parts
C145 C283 = CAP CER 22PF 50V C0G/NPO 0402: 22 pF ±2% 50V Ceramic Capacitor C0G, NP0 0402 (1005 Metric); Dielectric: NPO; Value: 22p; Voltage: 50V
  C283: Supplier 1: Digi-Key; Supplier Part Number 1: 311-1652-1-ND
C201#2 C202#2 C203#2 C239 C240 = CAP CER 10UF 6.3V X5R 0402: 10 µF ±20% 6.3V Ceramic Capacitor X5R 0402 (1005 Metric); Supplier 1: Digi-Key; Supplier Part Number 1: 490-GRM155R60J106ME05JCT-ND; Value: 10u; Voltage: 6.3V; Dielectric: X5R
C204#2 C205#2 C206#2 C207#2 C208#2 C209#2 C210#2 C211#2 C212#2 C213#2 C214#2 C215-C238 C241-C249 C251 C253 C256 C257 = CAP CER 100NF 16V X7R 0201: 100 nF ±10% 16V Ceramic Capacitor X7R 0201 (0603 Metric); Voltage: 16V; Dielectric: X7R; Supplier 1: Digi-Key; Supplier Part Number 1: 490-GRM033Z71C104KE14DCT-ND; Value: 100n
C250 C252 C254 C255 = CAP CER 2.2UF 6.3V X5R 0201: 2.2 µF ±20% 6.3V Ceramic Capacitor X5R 0201 (0603 Metric); Voltage: 16V; Supplier 1: Digi-Key; Supplier Part Number 1: 478-KGM03CR50J225MHCT-ND; Dielectric: X5R; Value: 2.2u
FB5 FB6#1 FB7#1 = FERRITE BEAD 330 OHM 0603 1LN: 330 Ohms @ 100 MHz 1 Power Line Ferrite Bead 0603 (1608 Metric) 1.7A 80mOhm; Supplier 1: Digi-Key; Supplier Part Number 1: 490-5256-1-ND
J22 = CONN 14POS: Connector Header Surface Mount 14 position 0.050" (1.27mm); Supplier 1: Digi-Key; Supplier Part Number 1: ESHF-107-01-L-D-SM-ND
R91 = RES 100 OHM 1% 1/16W 0402: 100 Ohms ±1% 0.063W, 1/16W Chip Resistor 0402 (1005 Metric) Moisture Resistant Thick Film; Supplier 1: Digi-Key; Supplier Part Number 1: 13-RC0402FR-13100RLCT-ND; Value: 100
R138-R140 = RES 4.7K OHM 5% 1/16W 0402: 4.7 kOhms ±5% 0.063W, 1/16W Chip Resistor 0402 (1005 Metric) Moisture Resistant Thick Film; Supplier 1: Digi-Key; Supplier Part Number 1: 311-4.7KJRCT-ND; Value: 4.7k
R141 = RES 2.2K OHM 1% 1/16W 0402: 2.2 kOhms ±1% 0.063W, 1/16W Chip Resistor 0402 (1005 Metric) Moisture Resistant Thick Film; Supplier 1: Digi-Key; Supplier Part Number 1: 311-2.20KLRCT-ND; Value: 2.2k
R142 = RES 39 OHM 1% 1/16W 0402: 39 Ohms ±1% 0.063W, 1/16W Chip Resistor 0402 (1005 Metric) Moisture Resistant Thick Film; Value: 1k; Supplier 1: Digi-Key; Supplier Part Number 1: 311-1.00KLRCT-ND
R159 = RES 49.9 OHM 1% 1/16W 0402: 49.9 Ohms ±1% 0.063W, 1/16W Chip Resistor 0402 (1005 Metric) Moisture Resistant Thick Film; Supplier 1: Digi-Key; Supplier Part Number 1: 311-49.9LRCT-ND; Value: 49.9
TP12 = TP: PC Test Point Plating Surface Mount Mounting Type; Supplier 1: Digi-Key; Supplier Part Number 1: 2019-RCUCTECT-ND
U8 = TMS320F28388DZWTS: C28x C2000™ C28x Fixed-Point Microcontroller IC 32-Bit Dual-Core 200MHz 512KB (256K x 16) FLASH 337-NFBGA (16x16); Manufacturer: Texas Instruments; Datasheet Link: http://www.ti.com/lit/ds/symlink/tms320f28388d.pdf; Height: 1.4mm; Supplier 1: Mouser; Supplier Part Number 1: 595-F28388DZWTS; Manufacturer Part Number: F28388DZWTS
X2 = ECS-160-20-3X-TR: 20 MHz ±10ppm Crystal 10pF 40 Ohms 4-SMD, No Lead; Supplier 1: Digi-Key

## Sheet ethernet.SchDoc: Ethernet 100-Base-T Port
size A4; SheetNumber: 10; SheetTotal: 18
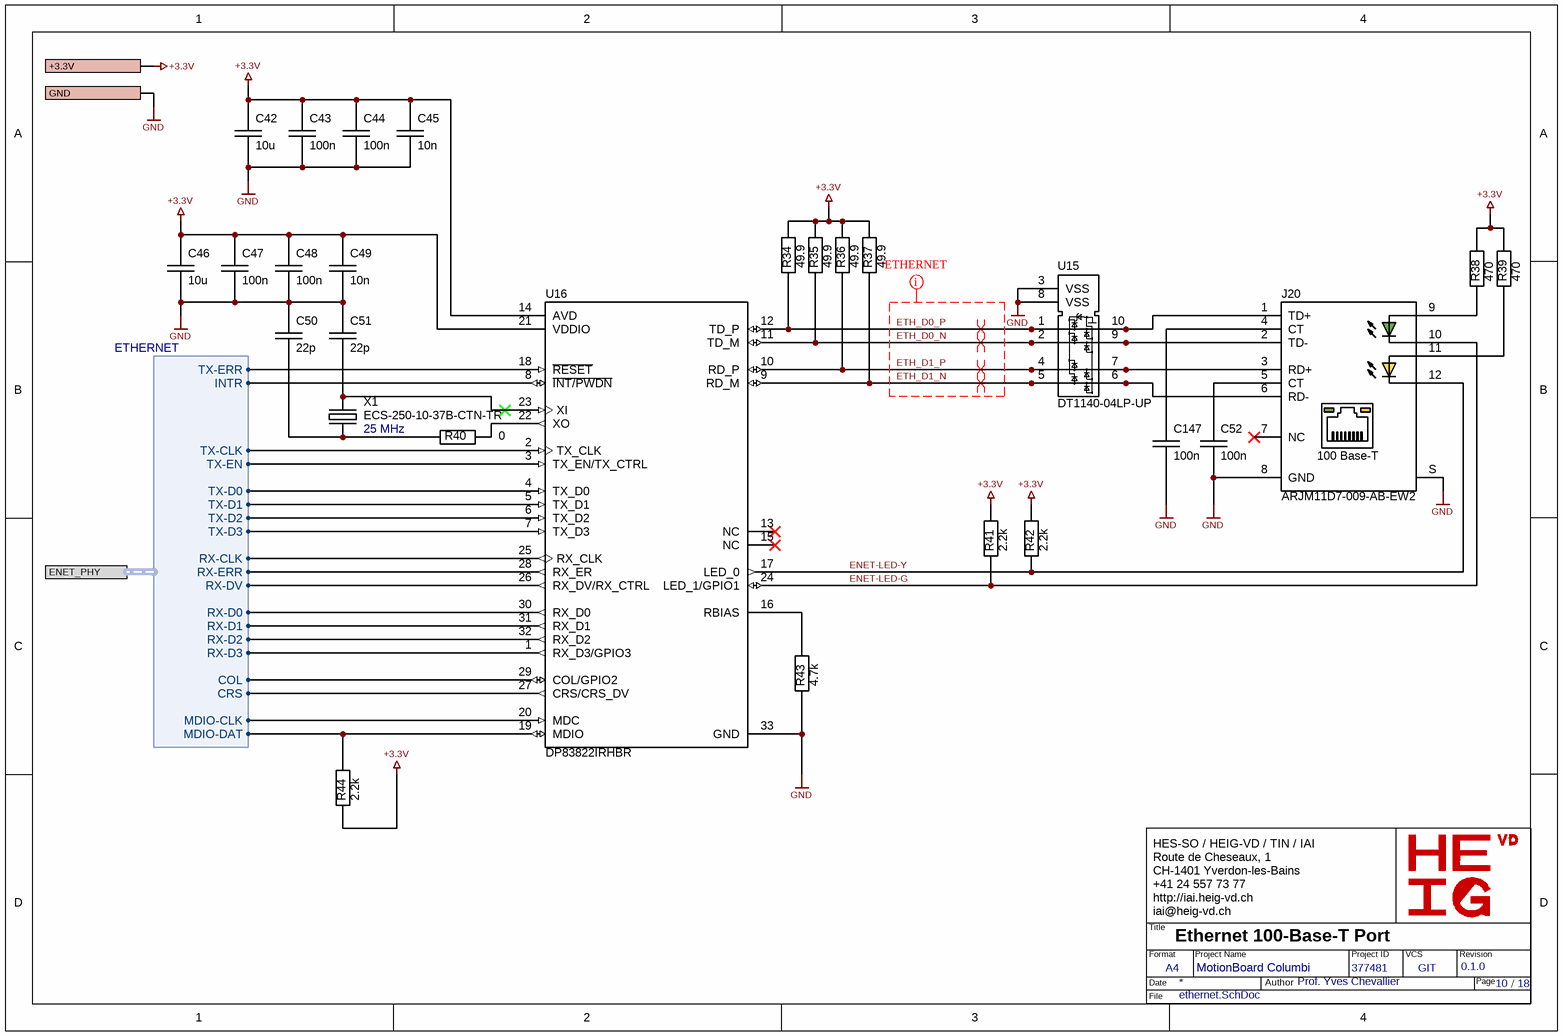
[diagram p8: ethernet.SchDoc]

### Parts
(Parts that share a designator on the sheet are numbered #1, #2 ... from top to bottom, then left to right.)
C42  10u  [SM/C0402]
C43  100n  [SM/C0402]
C44  100n  [SM/C0402]
C45  10n  [SM/C0402]
C46  10u  [SM/C0402]
C47  100n  [SM/C0402]
C48  100n  [SM/C0402]
C49  10n  [SM/C0402]
C50  22p  [SM/C0402]
C51  22p  [SM/C0402]
C52  100n  [SM/C0402]
C147  100n  [SM/C0402]
J20  ARJM11D7-009-AB-EW2  [ARJM11D7-009-AB-EW2]
R34  49.9  [SM/R0402]
R35  49.9  [SM/R0402]
R36  49.9  [SM/R0402]
R37  49.9  [SM/R0402]
R38  470  [SM/R0402]
R39  470  [SM/R0402]
R40  0  [SM/R0402]
R41  2.2k  [SM/R0402]
R42  2.2k  [SM/R0402]
R43  4.7k  [SM/R0402]
R44  2.2k  [SM/R0402]
U15#2  DT1140-04LP-UP  [SOT1165-1]
U16  DP83822IRHBR  [IC_DP83822IRHBR]
X1  ECS-250-10-37B-CTN-TR  value 25 MHz  [XTAL_ECS-160-9-37-CKM-TR]

### Ports
+3.3V, ENET_PHY (harness ETHERNET), GND

### Harnesses
ETHERNET: TX-D0, TX-D1, TX-D2, TX-D3, RX-D0, RX-D1, RX-D2, RX-D3, TX-CLK, TX-EN, RX-CLK, RX-DV, TX-ERR, COL, CRS, RX-ERR, MDIO-CLK, MDIO-DAT, INTR

### Nets
+3.3V: C42.1 C43.1 C44.1 C45.1 C46.1 C47.1 C48.1 C49.1 R34.1 R35.1 R36.1 R37.1 R38.1 R39.1 R41.2 R42.2 R44.1 U16.14(AVD) U16.21(VDDIO) ; port +3.3V
GND: C42.2 C43.2 C44.2 C45.2 C46.2 C47.2 C48.2 C49.2 C50.1 C51.2 C52.2 C147.2 J20.8(GND) J20.S R43.2 U15#2.3(VSS) U15#2.8(VSS) U16.33(GND) ; port GND
ENET-LED-G: J20.10(LED_GREEN2) R41.1 U16.24(LED_1/GPIO1)
ENET-LED-Y: J20.12(LED_YELLOW2) R42.1 U16.17(LED_0)
ETH_D0_N: J20.2(TD-) R35.2 U15#2.2 U15#2.9 U16.11(TD_M)
ETH_D0_P: J20.1(TD+) R34.2 U15#2.1 U15#2.10 U16.12(TD_P)
ETH_D1_N: J20.6(RD-) R37.2 U15#2.5 U15#2.6 U16.9(RD_M)
ETH_D1_P: J20.3(RD+) R36.2 U15#2.4 U15#2.7 U16.10(RD_P)
NetC50_2: C50.2 R40.1 X1.1
NetC51_1: C51.1 U16.23(XI) X1.3
NetC52_1: C52.1 J20.5(CT)
NetC147_1: C147.1 J20.4(CT)
NetJ20_9: J20.9(LED_GREEN1) R38.2
NetJ20_11: J20.11(LED_YELLOW1) R39.2
NetR40_2: R40.2 U16.22(XO)
NetR43_1: R43.1 U16.16(RBIAS)
NetR44_2: R44.2 U16.19(MDIO) ; port ENET_PHY.MDIO-DAT
NetU8_J3: U16.20(MDC) ; port ENET_PHY.MDIO-CLK
NetU8_L4: U16.8(~{INT/PWDN}) ; port ENET_PHY.INTR
NetU8_M2: U16.29(COL/GPIO2) ; port ENET_PHY.COL
NetU8_M3: U16.26(RX_DV/RX_CTRL) ; port ENET_PHY.RX-DV
NetU8_M4: U16.25(RX_CLK) ; port ENET_PHY.RX-CLK
NetU8_N2: U16.27(CRS/CRS_DV) ; port ENET_PHY.CRS
NetU8_N3: U16.30(RX_D0) ; port ENET_PHY.RX-D0
NetU8_N4: U16.28(RX_ER) ; port ENET_PHY.RX-ERR
NetU8_T8: U16.5(TX_D1) ; port ENET_PHY.TX-D1
NetU8_T12: U16.3(TX_EN/TX_CTRL) ; port ENET_PHY.TX-EN
NetU8_T15: U16.18(~{RESET}) ; port ENET_PHY.TX-ERR
NetU8_U8: U16.6(TX_D2) ; port ENET_PHY.TX-D2
NetU8_U12: U16.1(RX_D3/GPIO3) ; port ENET_PHY.RX-D3
NetU8_U15: U16.2(TX_CLK) ; port ENET_PHY.TX-CLK
NetU8_V8: U16.7(TX_D3) ; port ENET_PHY.TX-D3
NetU8_V12: U16.31(RX_D1) ; port ENET_PHY.RX-D1
NetU8_W10: U16.32(RX_D2) ; port ENET_PHY.RX-D2
NetU8_W16: U16.4(TX_D0) ; port ENET_PHY.TX-D0

Not connected (* = marked no-connect by the designer): J20 7(NC)*; U16 13(NC)* 15(NC)*

### Layout directives
differential pair; differential pair class Ethernet: ETH_D0_N, ETH_D0_P, ETH_D1_N, ETH_D1_P
net class ETH; rule Differential Pairs Routing [Pref Gap = 10.717mil    Min Gap  = 5.906mil    Max Gap  = 10.717milPref Width = 7.231mil    Min Width  = 5.906mil    Max Width  = 7.231mil]; rule Matched Net Lengths [Tolerance = 3mil]: ETH_D0_N, ETH_D0_P, ETH_D1_N, ETH_D1_P

### Notes on the sheet
- HES-SO / HEIG-VD / TIN / IAI
  Route de Cheseaux, 1
  CH-1401 Yverdon-les-Bains
  +41 24 557 73 77
  http://iai.heig-vd.ch
  iai@heig-vd.ch
- Title
- Format
- Date
- A4
- Project Name
- Author
- Project ID
- VCS
- Revision
- Page
- /
- File
- (in symbol CONN JACK 1PORT 100 BASE-T PCB) 100 Base-T

### Library data of the parts
C42 C46 = CAP CER 10UF 6.3V X5R 0402: as C201#2 on sheet dsp-supply; Supplier 1: Digi-Key; Supplier Part Number 1: 490-GRM155R60J106ME05JCT-ND; Value: 10u; Voltage: 6.3V; Dielectric: X5R
C43 C44 C47 C48 C52 C147 = CAP CER 100NF 25V X5R 0402: 100 nF ±10% 25V Ceramic Capacitor X5R 0402 (1005 Metric); Voltage: 25V; Dielectric: X5R; Supplier 1: Digi-Key; Supplier Part Number 1: 1276-1043-1-ND; Value: 100n
C45 C49 = CAP CER 10NF 50V X7R 0402: 10 nF ±10% 50V Ceramic Capacitor X7R 0402 (1005 Metric); Voltage: 50V; Dielectric: X7R; Supplier 1: Digi-Key; Supplier Part Number 1: 1276-1028-1-ND; Value: 10n
C50 C51 = CAP CER 22PF 50V C0G/NPO 0402: 22 pF ±2% 50V Ceramic Capacitor C0G, NP0 0402 (1005 Metric); Dielectric: NPO; Voltage: 50V; Value: 22p; Supplier 1: Digi-Key; Supplier Part Number 1: 311-1652-1-ND
J20 = CONN JACK 1PORT 100 BASE-T PCB: 1 Port RJ45Through Hole 10/100 Base-T, AutoMDIX; Supplier 1: Digi-Key; Supplier Part Number 1: 535-ARJM11D7-009-AB-EW2-ND
R34-R37 = RES 49.9 OHM 1% 1/16W 0402: as R159 on sheet dsp-supply; Supplier 1: Digi-Key; Supplier Part Number 1: 311-49.9LRCT-ND; Value: 49.9
R38 R39 = RES 470 OHM 1% 1/16W 0402: 470 Ohms ±1% 0.063W, 1/16W Chip Resistor 0402 (1005 Metric) Thick Film; Value: 470; Supplier 1: Digi-Key; Supplier Part Number 1: 13-RC0402FR-13470RLCT-ND
R40 = RES SMD 0 OHM JUMPER 1/10W 0402: 0 Ohms Jumper Chip Resistor 0402 (1005 Metric) Automotive AEC-Q200 Thick Film; Value: 0; Supplier 1: Digi-Key; Supplier Part Number 1: P0.0JCT-ND
R41 R42 R44 = RES 2.2K OHM 1% 1/16W 0402: as R141 on sheet dsp-supply; Value: 2.2k; Supplier 1: Digi-Key; Supplier Part Number 1: 311-2.20KLRCT-ND
R43 = RES 4.7K OHM 5% 1/16W 0402: as R138 on sheet dsp-supply; Value: 4.7k; Supplier 1: Digi-Key; Supplier Part Number 1: 311-4.7KJRCT-ND
U15#2 = DT1140-04LP-UP: TVS DIODE 5.5VWM 10VC U-DFN2510; Supplier 1: Digi-Key; Supplier Part Number 1: DT1140-04LP-7DICT-ND
U16 = DP83822IRHBR: Ethernet Interface 32-VQFN (5x5); Price: None; Package: None; Availability: Unavailable; MP: DP83822IRHBR; Value: *; Supplier 1: Digi-Key; Supplier Part Number 1: 296-47256-6-ND
X1 = ECS-250-10-37B-CTN-TR: 25 MHz ±10ppm Crystal 10pF 50 Ohms 4-SMD, No Lead; ESR: <50; Supplier 1: Digi-Key; Supplier Part Number 1: XC3065CT-ND

## Sheet psu.SchDoc: Power Supply (DSP + General)
size A3; SheetNumber: 3; SheetTotal: 18
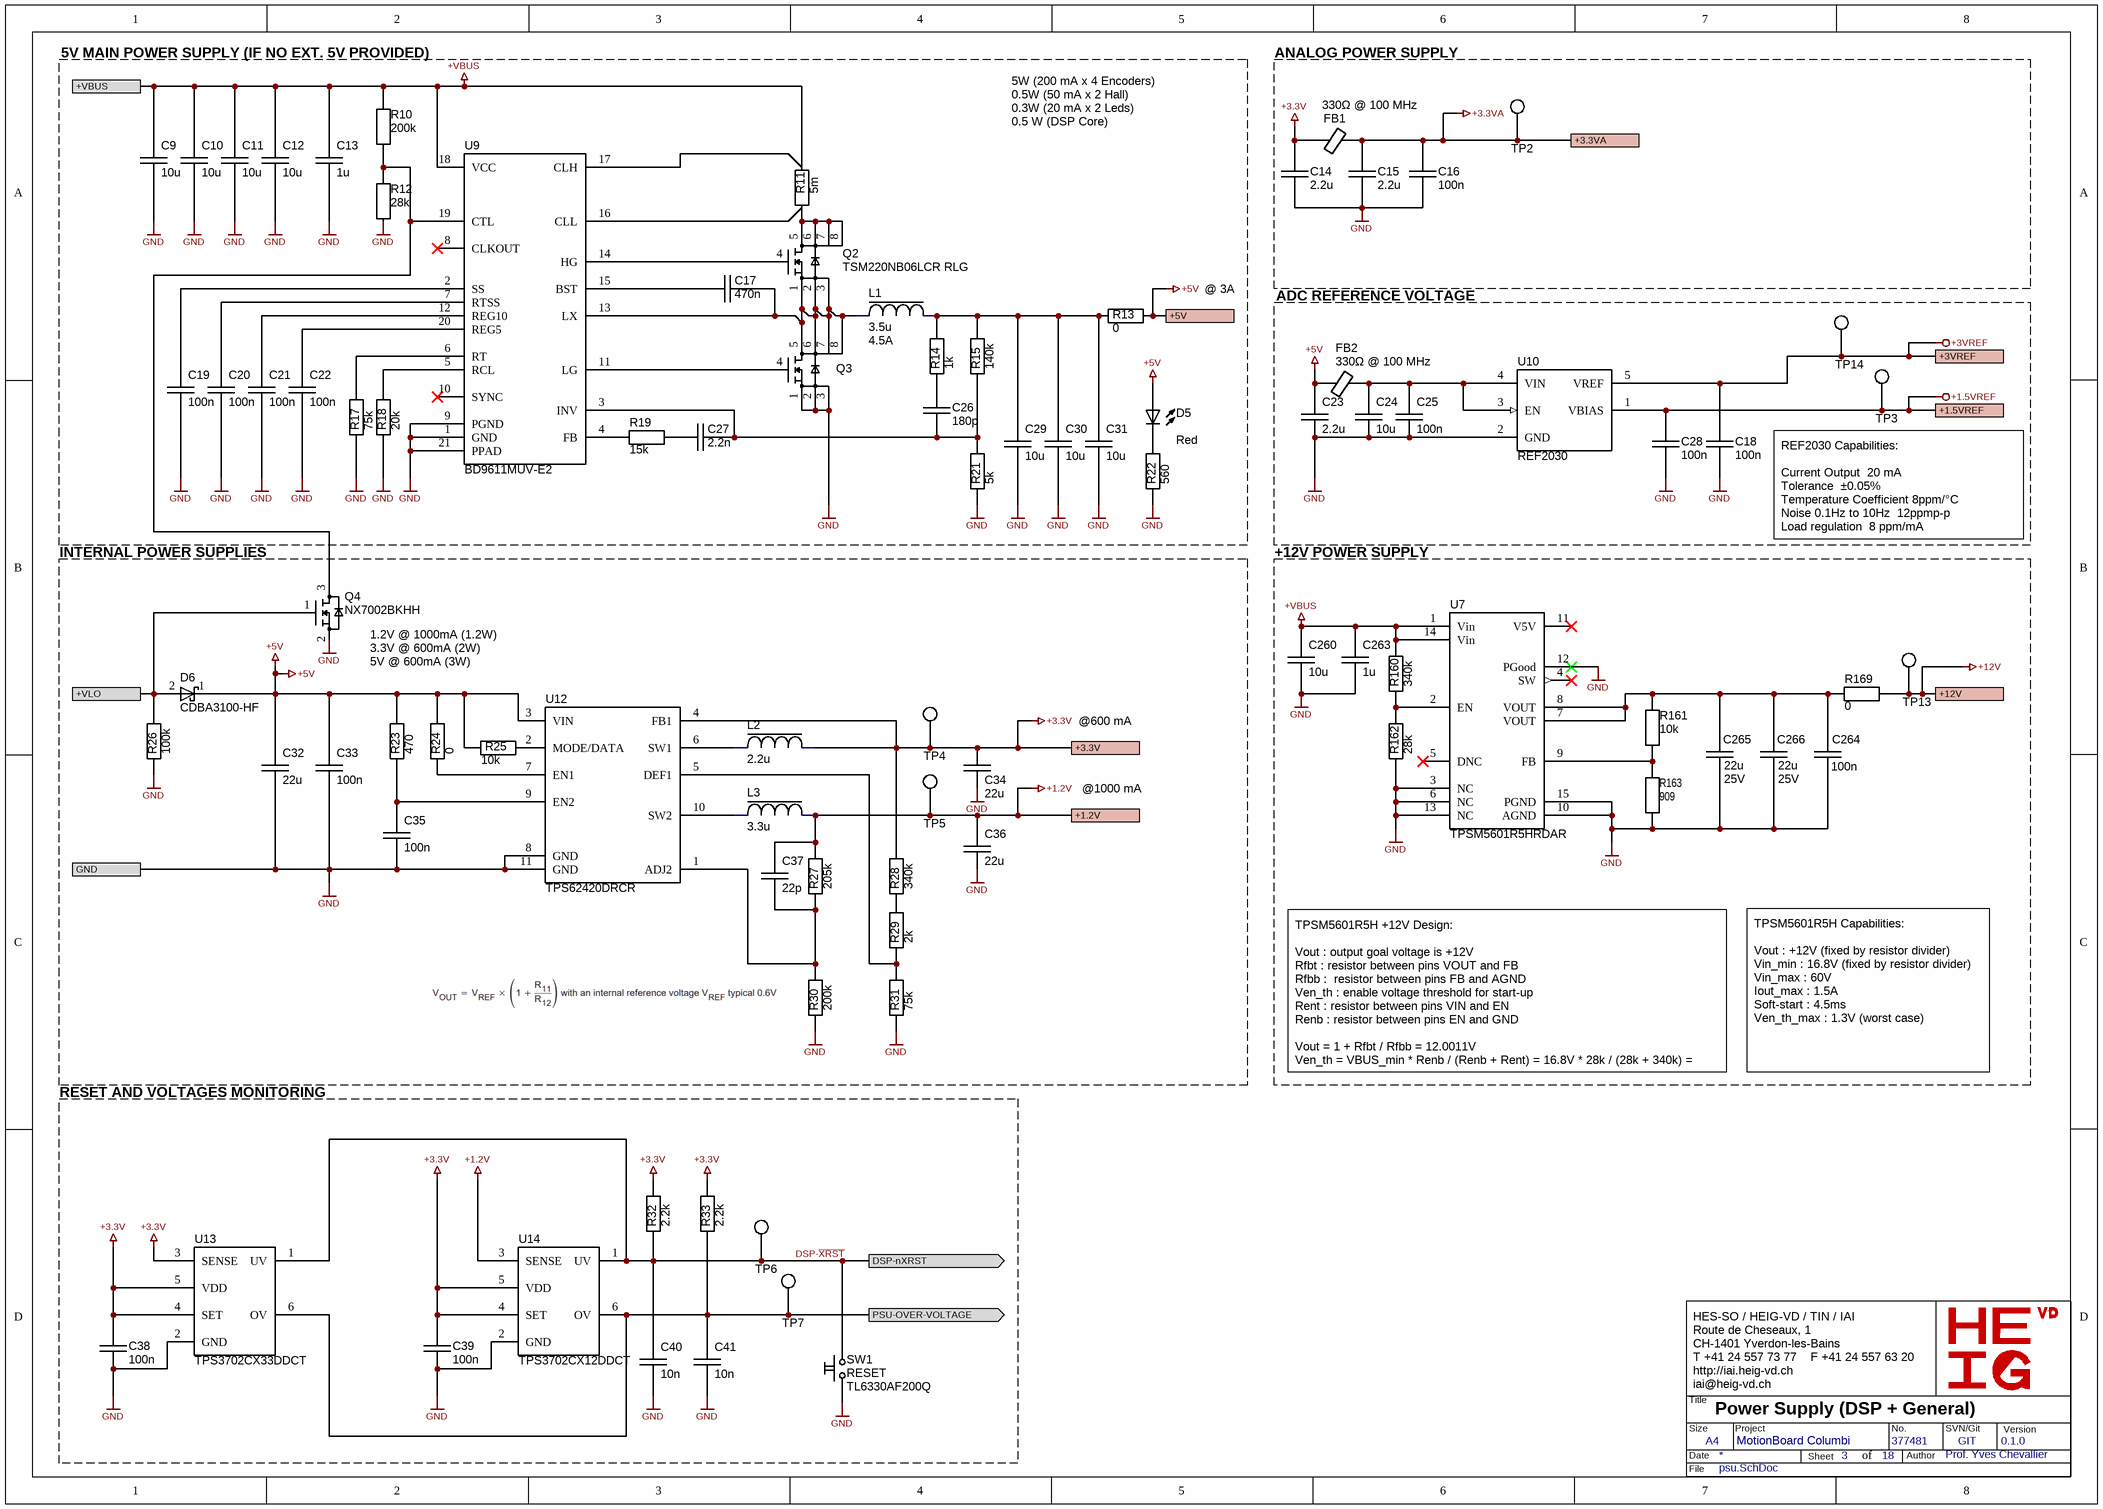
[diagram p9: psu.SchDoc]

### Parts
(Parts that share a designator on the sheet are numbered #1, #2 ... from top to bottom, then left to right.)
C9  10u  [SM/C0603]
C10  10u  [SM/C0603]
C11  10u  [SM/C0603]
C12  10u  [SM/C0603]
C13  1u  [SM/C0805]
C14  2.2u  [SM/C0402]
C15  2.2u  [SM/C0402]
C16  100n  [SM/C0402]
C17  470n  [SM/C0402]
C18  100n  [SM/C0402]
C19  100n  [SM/C0402]
C20  100n  [SM/C0402]
C21  100n  [SM/C0402]
C22  100n  [SM/C0402]
C23  2.2u  [SM/C0402]
C24  10u  [SM/C0603]
C25  100n  [SM/C0402]
C26  180p  [SM/C0402]
C27  2.2n  [SM/C0402]
C28  100n  [SM/C0402]
C29  10u  [SM/C0603]
C30  10u  [SM/C0603]
C31  10u  [SM/C0603]
C32  22u  [SM/C0402]
C33  100n  [SM/C0402]
C34  22u  [SM/C0402]
C35  100n  [SM/C0402]
C36  22u  [SM/C0402]
C37  22p  [SM/C0402]
C38  100n  [SM/C0402]
C39  100n  [SM/C0402]
C40  10n  [SM/C0402]
C41  10n  [SM/C0402]
C260  10u  [SM/C0603]
C263  1u  [SM/C0805]
C264  100n  [SM/C0402]
C265  22u  Voltage: 25V  [SM/C0805]
C266  22u  Voltage: 25V  [SM/C0805]
D5  Color: Red  [SM/LED0603]  (hidden comment: 150060SS75000)
D6  CDBA3100-HF  [DO214AC]
FB1  value 330Ω @ 100 MHz  [SM/L0603]  (hidden comment: BLM18KG331SN1D)
FB2  value 330Ω @ 100 MHz  [SM/L0603]  (hidden comment: BLM18KG331SN1D)
L1  value 3.5u  Isat: 4.5A  [IND_1255AY-4R7M=P3]  (hidden comment: 1255AY-4R7M=P3)
L2  2.2u  [SM/L/SRN3010TA]
L3  3.3u  [SM/L/SRN3010TA]
Q2  TSM220NB06LCR RLG  [TRANS_TSM220NB06LCR_RLG]
Q3  TSM220NB06LCR RLG  [TRANS_TSM220NB06LCR_RLG]  (value not drawn)
Q4  NX7002BKHH  [SOT8001/DFN0606-3]
R10  200k  [SM/R0402]
R11  5m  [SM/C0612]
R12  28k  [SM/R0402]
R13  0  [SM/R1206]
R14  1k  [SM/R0402]
R15  140k  [SM/R0402]
R17  75k  [SM/R0402]
R18  20k  [SM/R0402]
R19  15k  [SM/R0402]
R21  5k  [SM/R0402]
R22  560  [SM/R0402]
R23  470  [SM/R0402]
R24  0  [SM/R0402]
R25  10k  [SM/R0402]
R26  100k  [SM/R0805]
R27  205k  [SM/R0402]
R28  340k  [SM/R0402]
R29  2k  [SM/R0402]
R30  200k  [SM/R0402]
R31  75k  [SM/R0402]
R32  2.2k  [SM/R0402]
R33  2.2k  [SM/R0402]
R160  340k  [SM/R0402]
R161  10k  [SM/R0402]
R162  28k  [SM/R0402]
R163  909  [SM/R0402]
R169  0  [SM/R1206]
SW1  RESET  value TL6330AF200Q  [PB TL6330]
TP2  RCUCTE  [TP/RCUCT]  (value not drawn)
TP3  RCUCTE  [TP/RCUCT]  (value not drawn)
TP4  RCUCTE  [TP/RCUCT]  (value not drawn)
TP5  RCUCTE  [TP/RCUCT]  (value not drawn)
TP6  RCUCTE  [TP/RCUCT]  (value not drawn)
TP7#1  RCUCTE  [TP/RCUCT]  (value not drawn)
TP13  RCUCTE  [TP/RCUCT]  (value not drawn)
TP14  RCUCTE  [TP/RCUCT]  (value not drawn)
U7#2  TPSM5601R5HRDAR  [TPSM5601R5Hx]
U9  BD9611MUV-E2  [QFN50P400X400X90-21N]
U10  REF2030  [SOT95P280X110-5N]
U12  TPS62420DRCR  [IC_TPS62420DRCR]
U13  TPS3702CX33DDCT  [SOT23-6]
U14  TPS3702CX12DDCT  [SOT23-6]

### Blocks framed on the sheet
5V MAIN POWER SUPPLY (IF NO EXT. 5V PROVIDED): C9-C13 C17 C19-C22 C26 C27 C29-C31 D5 L1 Q2 Q3 R10-R15 R17-R19 R21 R22 U9
ANALOG POWER SUPPLY: C14-C16 FB1 TP2
ADC REFERENCE VOLTAGE: C18 C23-C25 C28 FB2 TP3 TP14 U10
INTERNAL POWER SUPPLIES: C32-C37 D6 L2 L3 Q4 R23-R31 TP4 TP5 U12
+12V POWER SUPPLY: C260 C263-C266 R160-R163 R169 TP13 U7#2
RESET AND VOLTAGES MONITORING: C38-C41 R32 R33 SW1 TP6 TP7#1 U13 U14

### Ports
+1.2V, +1.5VREF, +3.3V, +3.3VA, +3VREF, +5V, +12V, +VBUS, +VLO, DSP-nXRST (out), GND, PSU-OVER-VOLTAGE (out)

### Nets
+1.2V: C36.1 C37.1 L3.1 R27.1 TP5.1 U14.3(SENSE) ; port +1.2V
+1.5VREF: C28.1 TP3.1 U10.1(VBIAS) ; port +1.5VREF
+3.3V: C14.1 C34.1 C38.1 C39.1 FB1.1 L2.1 R28.1 R32.1 R33.1 TP4.1 U12.4(FB1) U13.3(SENSE) U13.4(SET) U13.5(VDD) U14.4(SET) U14.5(VDD) ; port +3.3V
+3.3VA: C15.1 C16.1 FB1.2 TP2.1 ; port +3.3VA
+3VREF: C18.1 TP14.1 U10.5(VREF) ; port +3VREF
+5V: C23.1 C32.1 C33.1 D5.1 D6.1(K) FB2.1 R13.1 R23.2 R24.2 R25.2 U12.3(VIN) ; port +5V
+12V: R169.1 TP13.1 ; port +12V
+VBUS: C9.1 C10.1 C11.1 C12.1 C13.1 C260.1 C263.1 R10.2 R11.3 R160.1 U7#2.1(Vin) U7#2.14(Vin) U9.18(VCC) ; port +VBUS  [project net VBUS]
GND: C9.2 C10.2 C11.2 C12.2 C13.2 C14.2 C15.2 C16.2 C18.2 C19.2 C20.2 C21.2 C22.2 C23.2 C24.2 C25.2 C28.2 C29.2 C30.2 C31.2 C32.2 C33.2 C34.2 C35.2 C36.2 C38.2 C39.2 C40.2 C41.2 C260.2 C263.2 C264.2 C265.1 C266.1 Q3.1(S) Q3.2(S) Q3.3(S) Q4.2(VCC) R12.1 R17.1 R18.1 R21.1 R22.1 R26.1 R30.2 R31.2 R162.1 R163.1 SW1.1 U7#2.3(NC) U7#2.6(NC) U7#2.10(AGND) U7#2.12(PGood) U7#2.13(NC) U7#2.15(PGND) U9.1(GND) U9.9(PGND) U9.21(PPAD) U10.2(GND) U12.8(GND) U12.11(GND) U13.2(GND) U14.2(GND) ; port GND
+VLO: D6.2(A) Q4.1(VCC) R26.2 ; port +VLO
DSP-~{XRST}: C40.1 R32.2 SW1.2 TP6.1 U13.1(UV) U14.1(UV) ; port DSP-nXRST
PSU-OVER-VOLTAGE: C41.1 R33.2 TP7#1.1 U13.6(OV) U14.6(OV) ; port PSU-OVER-VOLTAGE
NetC17_1: C17.1 U9.15(BST)
NetC17_2: C17.2 L1.2 Q2.1(S) Q2.2(S) Q2.3(S) Q3.5(D) Q3.6(D) Q3.7(D) Q3.8(D) U9.13(LX)
NetC19_1: C19.1 U9.2(SS)
NetC20_1: C20.1 U9.7(RTSS)
NetC21_1: C21.1 U9.12(REG10)
NetC22_1: C22.1 U9.20(REG5)
NetC24_1: C24.1 C25.1 FB2.2 U10.3(EN) U10.4(VIN)
NetC26_1: C26.1 R14.1
NetC26_2: C26.2 C27.1 R15.1 R21.2 U9.3(INV)
NetC27_2: C27.2 R19.2
NetC29_1: C29.1 C30.1 C31.1 L1.1 R13.2 R14.2 R15.2
NetC35_1: C35.1 R23.1 U12.9(EN2)
NetC37_2: C37.2 R27.2 R30.1 U12.1(ADJ2)
NetC264_1: C264.1 C265.2 C266.2 R161.1 R169.2 U7#2.7(VOUT) U7#2.8(VOUT)
NetD5_2: D5.2 R22.2
NetL2_2: L2.2 U12.6(SW1)
NetL3_2: L3.2 U12.10(SW2)
NetQ2_4: Q2.4(Gate) U9.14(HG)
NetQ2_5: Q2.5(D) Q2.6(D) Q2.7(D) Q2.8(D) R11.2
NetQ3_4: Q3.4(Gate) U9.11(LG)
NetQ4_3: Q4.3(VCC) R10.1 R12.2 U9.19(CTL)
NetR11_1: R11.1 U9.16(CLL)
NetR11_4: R11.4 U9.17(CLH)
NetR17_2: R17.2 U9.6(RT)
NetR18_2: R18.2 U9.5(RCL)
NetR19_1: R19.1 U9.4(FB)
NetR24_1: R24.1 U12.7(EN1)
NetR25_1: R25.1 U12.2(MODE/DATA)
NetR28_2: R28.2 R29.1
NetR29_2: R29.2 R31.1 U12.5(DEF1)
NetR160_2: R160.2 R162.2 U7#2.2(EN)
NetR161_2: R161.2 R163.2 U7#2.9(FB)

Not connected (* = marked no-connect by the designer): U7#2 4(SW)* 5(DNC)* 11(V5V)*; U9 8(CLKOUT)* 10(SYNC)*

### Notes on the sheet
- 5W (200 mA x 4 Encoders)
  0.5W (50 mA x 2 Hall)
  0.3W (20 mA x 2 Leds)
  0.5 W (DSP Core)
- @ 3A
- REF2030 Capabilities:
  Current Output		20 mA
  Tolerance		±0.05%
  Temperature Coefficient	8ppm/°C
  Noise 0.1Hz to 10Hz		12ppmp-p
  Load regulation		8 ppm/mA
- 1.2V @ 1000mA (1.2W)
  3.3V @ 600mA (2W)
  5V @ 600mA (3W)
- @600 mA
- @1000 mA
- TPSM5601R5H +12V Design:
  Vout : output goal voltage is +12V
  Rfbt : resistor between pins VOUT and FB
  Rfbb :  resistor between pins FB and AGND
  Ven_th : enable voltage threshold for start-up
  Rent : resistor between pins VIN and EN
  Renb : resistor between pins EN and GND
  Vout = 1 + Rfbt / Rfbb = 12.0011V
  Ven_th = VBUS_min * Renb / (Renb + Rent) = 16.8V * 28k / (28k + 340k) = 1.3V
- TPSM5601R5H Capabilities:
  Vout : +12V (fixed by resistor divider)
  Vin_min : 16.8V (fixed by resistor divider)
  Vin_max : 60V
  Iout_max : 1.5A
  Soft-start : 4.5ms
  Ven_th_max : 1.3V (worst case)
- HES-SO / HEIG-VD / TIN / IAI
  Route de Cheseaux, 1
  CH-1401 Yverdon-les-Bains
  T +41 24 557 73 77    F +41 24 557 63 20
  http://iai.heig-vd.ch
  iai@heig-vd.ch
- Title
- Size
- Date
- A4
- Project
- Sheet
- of
- No.
- Author
- SVN/Git
- Version
- File

### Library data of the parts
C9-C12 C24 C29-C31 C260 = CAP CER 10UF 25V X5R 0603: 10 µF ±20% 25V Ceramic Capacitor X5R 0603 (1608 Metric); Dielectric: X7R; Voltage: 25V; Supplier 1: Digi-Key; Supplier Part Number 1: 490-7202-1-ND; Value: 10u
C13 C263 = CAP CER 1UF 100V X7S 0805: 1 µF ±10% 100V Ceramic Capacitor X7S 0805 (2012 Metric); Voltage: 100V; Dielectric: X7S; Supplier 1: Digi-Key; Supplier Part Number 1: 490-10918-1-ND; Value: 1u
C14 C15 C23 = CAP CER 2.2UF 16V X5R 0402: 2.2 µF ±10% 16V Ceramic Capacitor X5R 0402 (1005 Metric); Voltage: 16V; Supplier 1: Digi-Key; Supplier Part Number 1: 490-10695-1-ND; Dielectric: X5R; Value: 2.2u
C16 C18-C22 C25 C28 C33 C35 C38 C39 C264 = CAP CER 100NF 25V X5R 0402: as C43 on sheet ethernet; Voltage: 25V; Dielectric: X5R; Supplier 1: Digi-Key; Supplier Part Number 1: 1276-1043-1-ND; Value: 100n
C17 = CAP CER 470NF 50V X5R 0402: 470 nF ±10% 50V Ceramic Capacitor X5R 0402 (1005 Metric); Voltage: 50V; Dielectric: X5R; Value: 470n; Supplier 1: Digi-Key; Supplier Part Number 1: 490-16354-1-ND
C26 = CAP CER 180PF 50V C0G/NP0 0402: 180 pF ±5% 50V Ceramic Capacitor C0G, NP0 0402 (1005 Metric); Dielectric: NPO; Voltage: 50V; Supplier 1: Digi-Key; Supplier Part Number 1: 490-GCM1555C1H181JA16DCT-ND; Value: 180p
C27 = CAP CER 2.2NF 50V X7R 0402: 2.2 nF ±10% 50V Ceramic Capacitor X7R 0402 (1005 Metric); Voltage: 50V; Dielectric: X7R; Supplier 1: Digi-Key; Supplier Part Number 1: 311-3072-1-ND
C32 C34 C36 = CAP CER 22UF 6.3V X5R 0402: 22 µF ±20% 6.3V Ceramic Capacitor X5R 0402 (1005 Metric); Voltage: 6.3V; Dielectric: X5R; Supplier 1: Digi-Key; Supplier Part Number 1: 478-KGM05CR50J226MHCT-ND; Value: 22u
C37 = CAP CER 22PF 50V C0G/NPO 0402: as C50 on sheet ethernet; Voltage: 50V; Supplier 1: Digi-Key; Supplier Part Number 1: 311-1652-1-ND; Value: 22p
C40 C41 = CAP CER 10NF 50V X7R 0402: as C45 on sheet ethernet; Voltage: 50V; Dielectric: X7R; Supplier 1: Digi-Key; Supplier Part Number 1: 1276-1028-1-ND; Value: 10n
C265 C266 = CAP CER 22UF 25V X5R 0805: 22 µF ±20% 25V Ceramic Capacitor X5R 0805 (2012 Metric); Dielectric: X5R; Supplier 1: Digi-Key; Supplier Part Number 1: 490-14661-1-ND
D5 = LED RED CLEAR 0603 SMD: Red 630nm LED Indication - Discrete 1.9V 0603 (1608 Metric); Supplier 1: Digi-Key; Supplier Part Number 1: 732-4979-1-ND
D6 = DIODE SCHOTTKY 100V 3A DO214AC: Diode 100 V 3A Surface Mount DO-214AC (SMA); Supplier 1: Digi-Key; Supplier Part Number 1: 641-1747-1-ND
FB1 FB2 = FERRITE BEAD 330 OHM 0603 1LN: as FB5 on sheet dsp-supply; Supplier 1: Digi-Key; Supplier Part Number 1: 490-5256-1-ND
L1 = 1255AY-4R7M=P3: 4.7 µH Shielded Drum Core, Wirewound Inductor 4 A 23mOhm Nonstandard; Supplier 1: Digi-Key; Supplier Part Number 1: 490-10812-1-ND
L2 = SRN3010TA-2R2M: 2.2 µH Semi-Shielded Drum Core, Wirewound Inductor 1.7 A 90mOhm Nonstandard; Isat: 1.3A; Value: 2.2u; Supplier 1: Digi-Key; Supplier Part Number 1: SRN3010TA-2R2MCT-ND
L3 = SRN3010TA-3R3M: 3.3 µH Semi-Shielded Drum Core, Wirewound Inductor 1.5 A 130mOhm Nonstandard; Isat: 1.1A; Value: 3.3u; Supplier 1: Digi-Key; Supplier Part Number 1: SRN3010TA-3R3MCT-ND
Q2 Q3 = BSC0502NSIATMA1: N-Channel 60 V 8A (Ta), 35A (Tc) 3.1W (Ta), 68W (Tc) Surface Mount 8-PDFN (5x6); Supplier 1: Digi-Key; Supplier Part Number 1: TSM220NB06LCRRLGCT-ND
Q4 = 2N7002: N-Channel 60 V 350mA (Ta) 380mW (Ta), 2.8W (Tc) Surface Mount DFN0606-3; Value: 2N7002; Supplier 1: Digi-Key; Supplier Part Number 1: 1727-8574-1-ND
R10 R30 = RES 200K OHM 1% 1/16W 0402: 200 kOhms ±1% 0.063W, 1/16W Chip Resistor 0402 (1005 Metric) Moisture Resistant Thick Film; Value: 200k; Supplier 1: Digi-Key; Supplier Part Number 1: 311-200KLRCT-ND
R11 = RES 0.005 OHM 1W 1206 WIDE: 5 mOhms ±1% 1W Chip Resistor Wide 1206 (3216 Metric), 0612 Automotive AEC-Q200, Current Sense Metal Foil; Supplier 1: Digi-Key; Supplier Part Number 1: 408-1969-1-ND; Value: 5m
R12 R162 = RES 28K OHM 1% 1/16W 0402: 28 kOhms ±1% 0.063W, 1/16W Chip Resistor 0402 (1005 Metric) Moisture Resistant Thick Film; Supplier 1: Digi-Key; Supplier Part Number 1: 311-28.0KLRCT-ND; Value: 28k
R13 R169 = RES 0 OHM JUMPER 1/4W 1206: 0 Ohms Jumper Chip Resistor 1206 (3216 Metric) Automotive AEC-Q200 Thick Film; Supplier 1: Digi-Key; Supplier Part Number 1: RMCF1206ZT0R00CT-ND; Value: 0
R14 = RES 1K OHM 1% 1/16W 0402: 1 kOhms ±1% 0.063W, 1/16W Chip Resistor 0402 (1005 Metric) Moisture Resistant Thick Film; Supplier 1: Digi-Key; Supplier Part Number 1: 311-1.00KLRCT-ND; Value: 1k
R15 = RES 140K OHM 1% 1/16W 0402: 140 kOhms ±1% 0.063W, 1/16W Chip Resistor 0402 (1005 Metric) Moisture Resistant Thick Film; Supplier 1: Digi-Key; Supplier Part Number 1: YAG2978CT-ND; Value: 140k
R17 R31 = RES 75K OHM 1% 1/16W 0402: 75 kOhms ±1% 0.063W, 1/16W Chip Resistor 0402 (1005 Metric) Moisture Resistant Thick Film; Supplier 1: Digi-Key; Supplier Part Number 1: 311-75KLRCT-ND; Value: 75k
R18 = RES 20K OHM 1% 1/16W 0402: 20 kOhms ±1% 0.063W, 1/16W Chip Resistor 0402 (1005 Metric) Moisture Resistant Thick Film; Supplier 1: Digi-Key; Supplier Part Number 1: 311-20.0KLRCT-ND; Value: 20k
R19 = RES 15K OHM 1% 1/16W 0402: 15 kOhms ±1% 0.063W, 1/16W Chip Resistor 0402 (1005 Metric) Thick Film; Value: 15k; Supplier 1: Digi-Key; Supplier Part Number 1: 13-RC0402FR-1015KLCT-ND
R21 = RES 5K OHM 1% 1/16W 0402: 5 kOhms ±1% 0.063W, 1/16W Chip Resistor 0402 (1005 Metric) Moisture Resistant Thick Film; Supplier 1: Digi-Key; Supplier Part Number 1: 13-RC0402FR-075KLCT-ND; Value: 5k
R22 = RES 560 OHM 1% 1/16W 0402: 560 Ohms ±1% 0.063W, 1/16W Chip Resistor 0402 (1005 Metric) Thick Film; Value: 560; Supplier 1: Digi-Key; Supplier Part Number 1: 13-RC0402FR-13560RLCT-ND
R23 = RES 470 OHM 1% 1/16W 0402: as R38 on sheet ethernet; Value: 470; Supplier 1: Digi-Key; Supplier Part Number 1: 13-RC0402FR-13470RLCT-ND
R24 = RES SMD 0 OHM JUMPER 1/10W 0402: as R40 on sheet ethernet; Supplier 1: Digi-Key; Supplier Part Number 1: P0.0JCT-ND; Value: 0
R25 R161 = RES 10K OHM 1% 1/16W 0402: 10 kOhms ±1% 0.063W, 1/16W Chip Resistor 0402 (1005 Metric) Moisture Resistant Thick Film; Supplier 1: Digi-Key; Supplier Part Number 1: 1276-3431-1-ND; Value: 10k
R26 = RES 100K OHM 1% 1/16W 0402: 100 kOhms ±1% 0.063W, 1/16W Chip Resistor 0402 (1005 Metric) Moisture Resistant Thick Film; Supplier 1: Digi-Key; Supplier Part Number 1: 13-RC0402FR-13100KLCT-ND; Value: 100k
R27 = RES 205K OHM 1% 1/16W 0402: 205 kOhms ±1% 0.063W, 1/16W Chip Resistor 0402 (1005 Metric) Moisture Resistant Thick Film; Value: 205k; Supplier 1: Digi-Key; Supplier Part Number 1: YAG3050CT-ND
R28 R160 = RES 340K OHM 1% 1/16W 0402: 340 kOhms ±1% 0.063W, 1/16W Chip Resistor 0402 (1005 Metric) Moisture Resistant Thick Film; Value: 340k; Supplier 1: Digi-Key; Supplier Part Number 1: YAG3121CT-ND
R29 = RES SMD 2K OHM 0.5% 1/16W 0402: 2 kOhms ±0.5% 0.063W, 1/16W Chip Resistor 0402 (1005 Metric) Thin Film; Supplier 1: Digi-Key; Supplier Part Number 1: RR05P2.0KDCT-ND; Value: 2k
R32 R33 = RES 2.2K OHM 1% 1/16W 0402: as R141 on sheet dsp-supply; Supplier 1: Digi-Key; Supplier Part Number 1: 311-2.20KLRCT-ND; Value: 2.2k
R163 = RES 909 OHM 1% 1/16W 0402: 909 Ohms ±1% 0.063W, 1/16W Chip Resistor 0402 (1005 Metric) Moisture Resistant Thick Film; Supplier 1: Digi-Key; Supplier Part Number 1: YAG3256CT-ND
SW1 = SWTICH (1): Supplier 1: Digi-Key; Supplier Part Number 1: EG5546CT-ND
TP2-TP6 TP7#1 TP13 TP14 = TP: as TP12 on sheet dsp-supply; Supplier 1: Digi-Key; Supplier Part Number 1: 2019-RCUCTECT-ND
U7#2 = TPSM5601R5HRDAR: Non-Isolated PoL Module DC DC Converter 1 Output 1 ~ 16V 1.5A 4.2V - 60V Input; Supplier 1: Digi-Key; Supplier Part Number 1: 296-TPSM5601R5HRDARCT-ND
U9 = BD9611: Buck Regulator Positive Output Step-Down DC-DC Controller IC VQFN020V4040; Supplier 1: Digi-Key; Supplier Part Number 1: BD9611MUV-E2CT-ND; Supplier 2: Mouser; Supplier Part Number 2: 755-BD9611MUV-E2
U10 = REF2030: Series Voltage Reference IC Fixed 1.5V, 3V V ±0.05% 20 mA SOT-23-THIN; Supplier 1: Digi-Key; Supplier Part Number 1: 296-38496-1-ND
U13 = TPS3702CX33DDCT: Supervisor Open Drain or Open Collector 1 Channel SOT-23-THIN; Supplier 1: Digi-Key; Supplier Part Number 1: 296-39651-1-ND
U14 = TPS3702CX12DDCT: Supervisor Open Drain or Open Collector 1 Channel SOT-23-THIN; Supplier 1: Digi-Key; Supplier Part Number 1: 296-42074-1-ND
U12 = TPS62420DRCR: Supplier 1: Digi-Key; Supplier Part Number 1: 296-25650-6-ND